# EAGLE schematic Baseboard (EAGLE 9.6.2)

## Sheet 1 of 15
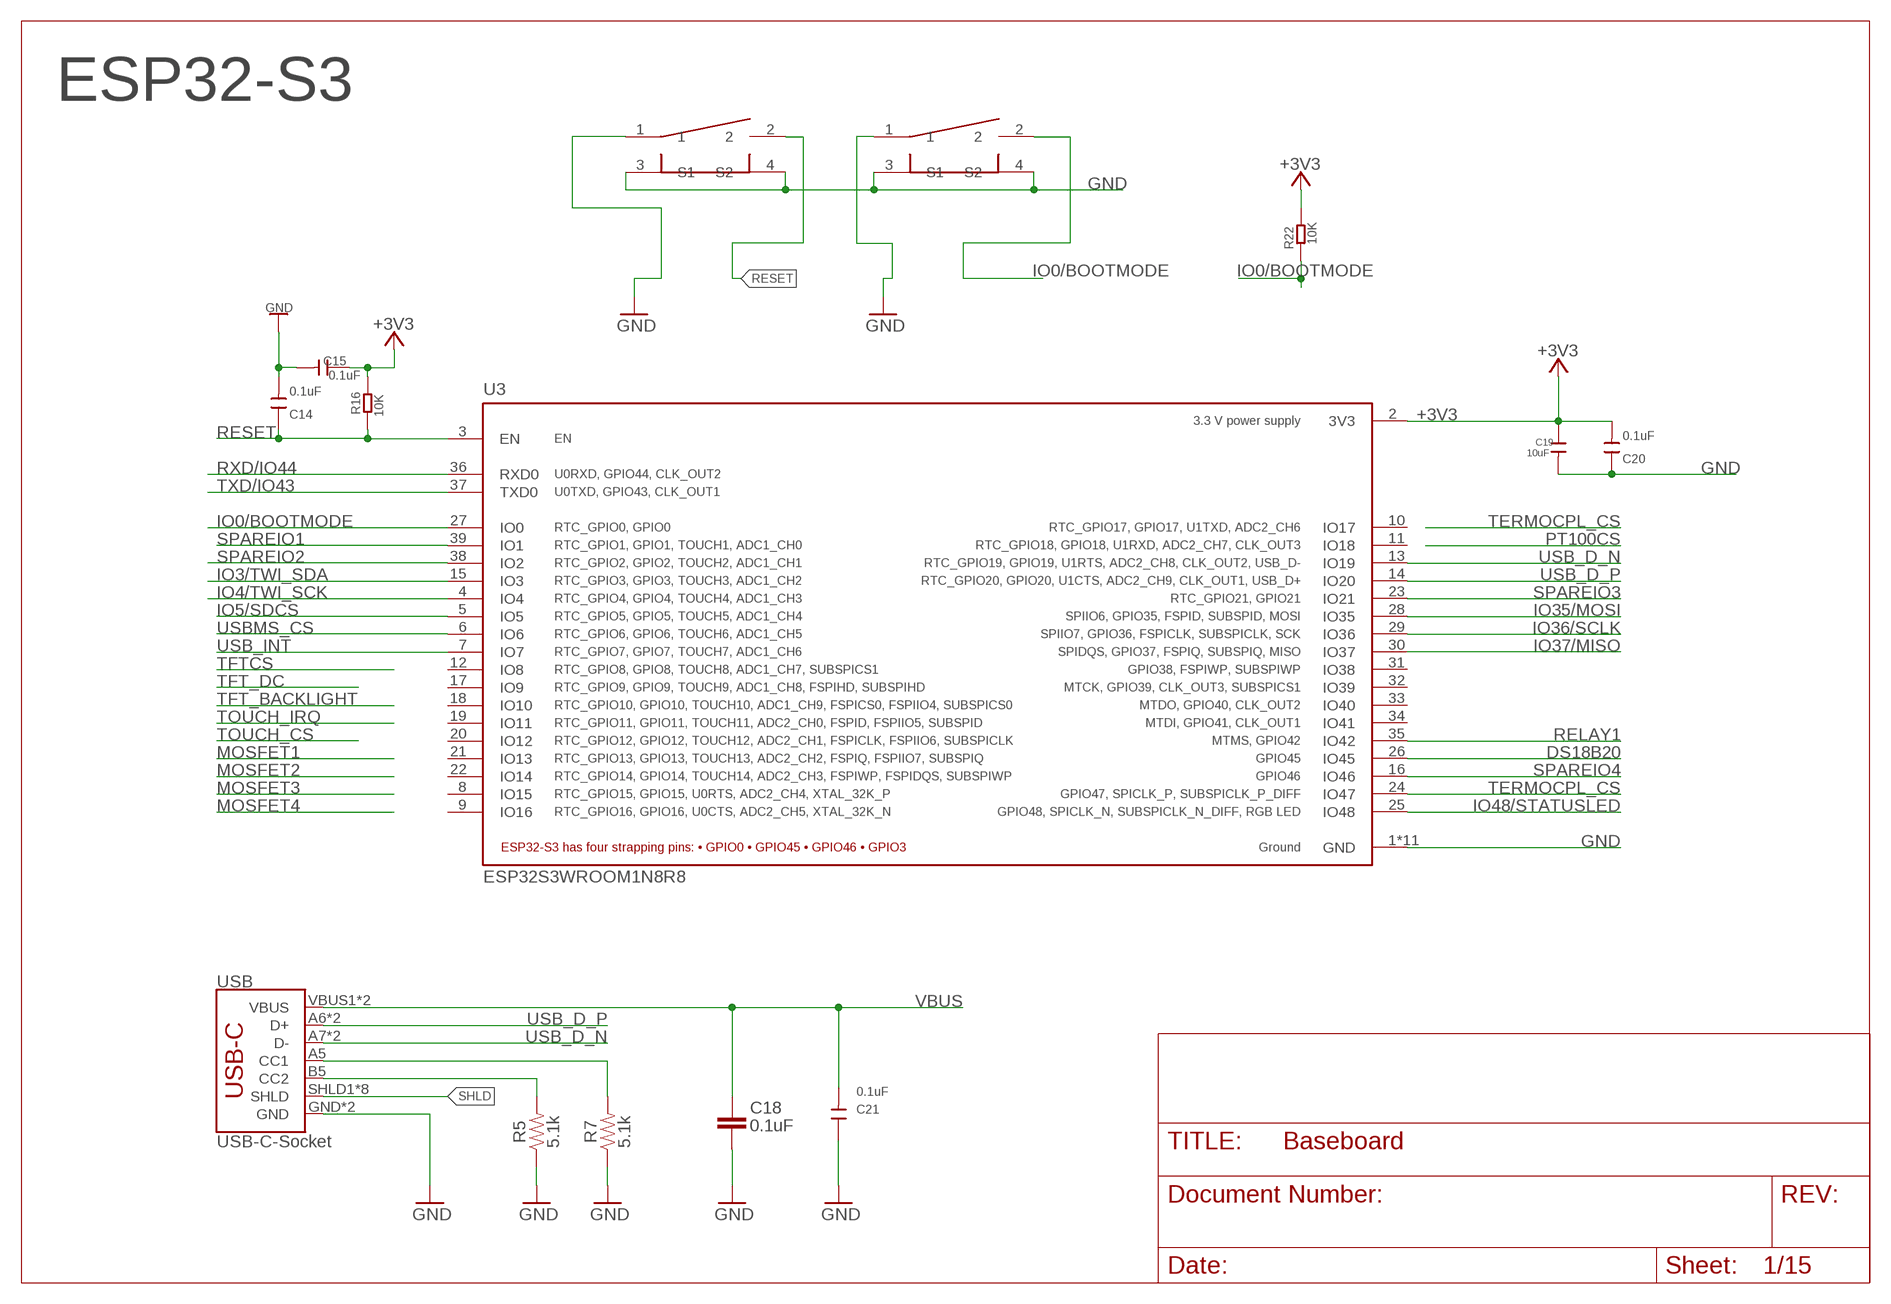
[diagram p0: schematic, sheet 1]

### Parts
C14  0.1uF  DISCRETE_C-0603  [DISCRETE_C0603]
C15  0.1uF  DISCRETE_C-0603  [DISCRETE_C0603]
C18  0.1uF  CAP0603-CAP  [0603-CAP]
C19  10uF  C-1206  [C1206]
C20  0.1uF  DISCRETE_C-0603  [DISCRETE_C0603]
C21  0.1uF  DISCRETE_C-0603  [DISCRETE_C0603]
MODE  RIGHTANGLETACTILE  [DP_DEVICES_SW_TACT_STANDARD_RIGHT_ANGLE]
R5  5.1k  5.1KOHM5.1KOHM-0603-1/10W-1%  [0603@1]
R7  5.1k  5.1KOHM5.1KOHM-0603-1/10W-1%  [0603@1]
R16  10K  R-0603  [R0603]
R22  10K  R-0603  [R0603]
RESET  RIGHTANGLETACTILE  [DP_DEVICES_SW_TACT_STANDARD_RIGHT_ANGLE]
U3  ESP32S3WROOM1N8R8  [XCVR_ESP32S3WROOM1N8R8]
USB  USB-C-Socket  USB_C16PIN  [USB-C-16P]

### Nets
+3V3: C15.1 C19.1 C20.2 R16.2 R22.2 U3.2(3V3) ; also sheet 2,6,7,8,9,10,11
CC1: R7.2 USB.A5(CC1)
CC2: R5.2 USB.B5(CC2)
DS18B20: U3.26(IO45) ; also sheet 12
GND: C14.2 C15.2 C18.2 C19.2 C20.1 C21.1 MODE.1 MODE.3(S1) MODE.4(S2) R5.1 R7.1 RESET.1 RESET.3(S1) RESET.4(S2) U3.1(GND) U3.40(GND) U3.41_1(GND) U3.41_2(GND) U3.41_3(GND) U3.41_4(GND) U3.41_5(GND) U3.41_6(GND) U3.41_7(GND) U3.41_8(GND) U3.41_9(GND) USB.GND USB.GND2(GND) ; also sheet 2,3,4,5,6,7,8,9,10,11,12,13,14,15
IO0/BOOTMODE: MODE.2 R22.1 U3.27(IO0)
IO3/TWI_SDA: U3.15(IO3) ; also sheet 3,4,5,10,11
IO4/TWI_SCK: U3.4(IO4) ; also sheet 3,4,5,10,11
IO5/SDCS: U3.5(IO5) ; also sheet 8
IO35/MOSI: U3.28(IO35) ; also sheet 3,7,8,9
IO36/SCLK: U3.29(IO36) ; also sheet 3,6,7,8,9
IO37/MISO: U3.30(IO37) ; also sheet 3,6,7,8,9
IO48/STATUSLED: U3.25(IO48) ; also sheet 3
RELAY1: U3.35(IO42) ; also sheet 12
RESET: C14.1 R16.1 RESET.2 U3.3(EN)
RXD/IO44: U3.36(RXD0) ; also sheet 3
SHLD: USB.SHLD1(SHLD) USB.SHLD2(SHLD) USB.SHLD3(SHLD) USB.SHLD4(SHLD) USB.SHLD5(SHLD) USB.SHLD6(SHLD) USB.SHLD7(SHLD) USB.SHLD8(SHLD)
SPAREIO1: U3.39(IO1) ; also sheet 3
SPAREIO2: U3.38(IO2) ; also sheet 3
SPAREIO3: U3.23(IO21) ; also sheet 3
SPAREIO4: U3.16(IO46) ; also sheet 3
TERMOCPL_CS: U3.24(IO47) ; also sheet 6
TXD/IO43: U3.37(TXD0) ; also sheet 3
USB_D_N: U3.13(IO19) USB.A7(D-) USB.B7(D-)
USB_D_P: U3.14(IO20) USB.A6(D+) USB.B6(D+)
USB_INT: U3.7(IO7) ; also sheet 9
USBMS_CS: U3.6(IO6) ; also sheet 9
VBUS: C18.1 C21.2 USB.VBUS1(VBUS) USB.VBUS2(VBUS) ; also sheet 2
Unconnected: U3.8(IO15) U3.9(IO16) U3.10(IO17) U3.11(IO18) U3.12(IO8) U3.17(IO9) U3.18(IO10) U3.19(IO11) U3.20(IO12) U3.21(IO13) U3.22(IO14) U3.31(IO38) U3.32(IO39) U3.33(IO40) U3.34(IO41)

### Notes on the sheet
- ESP32-S3

## Sheet 2 of 15
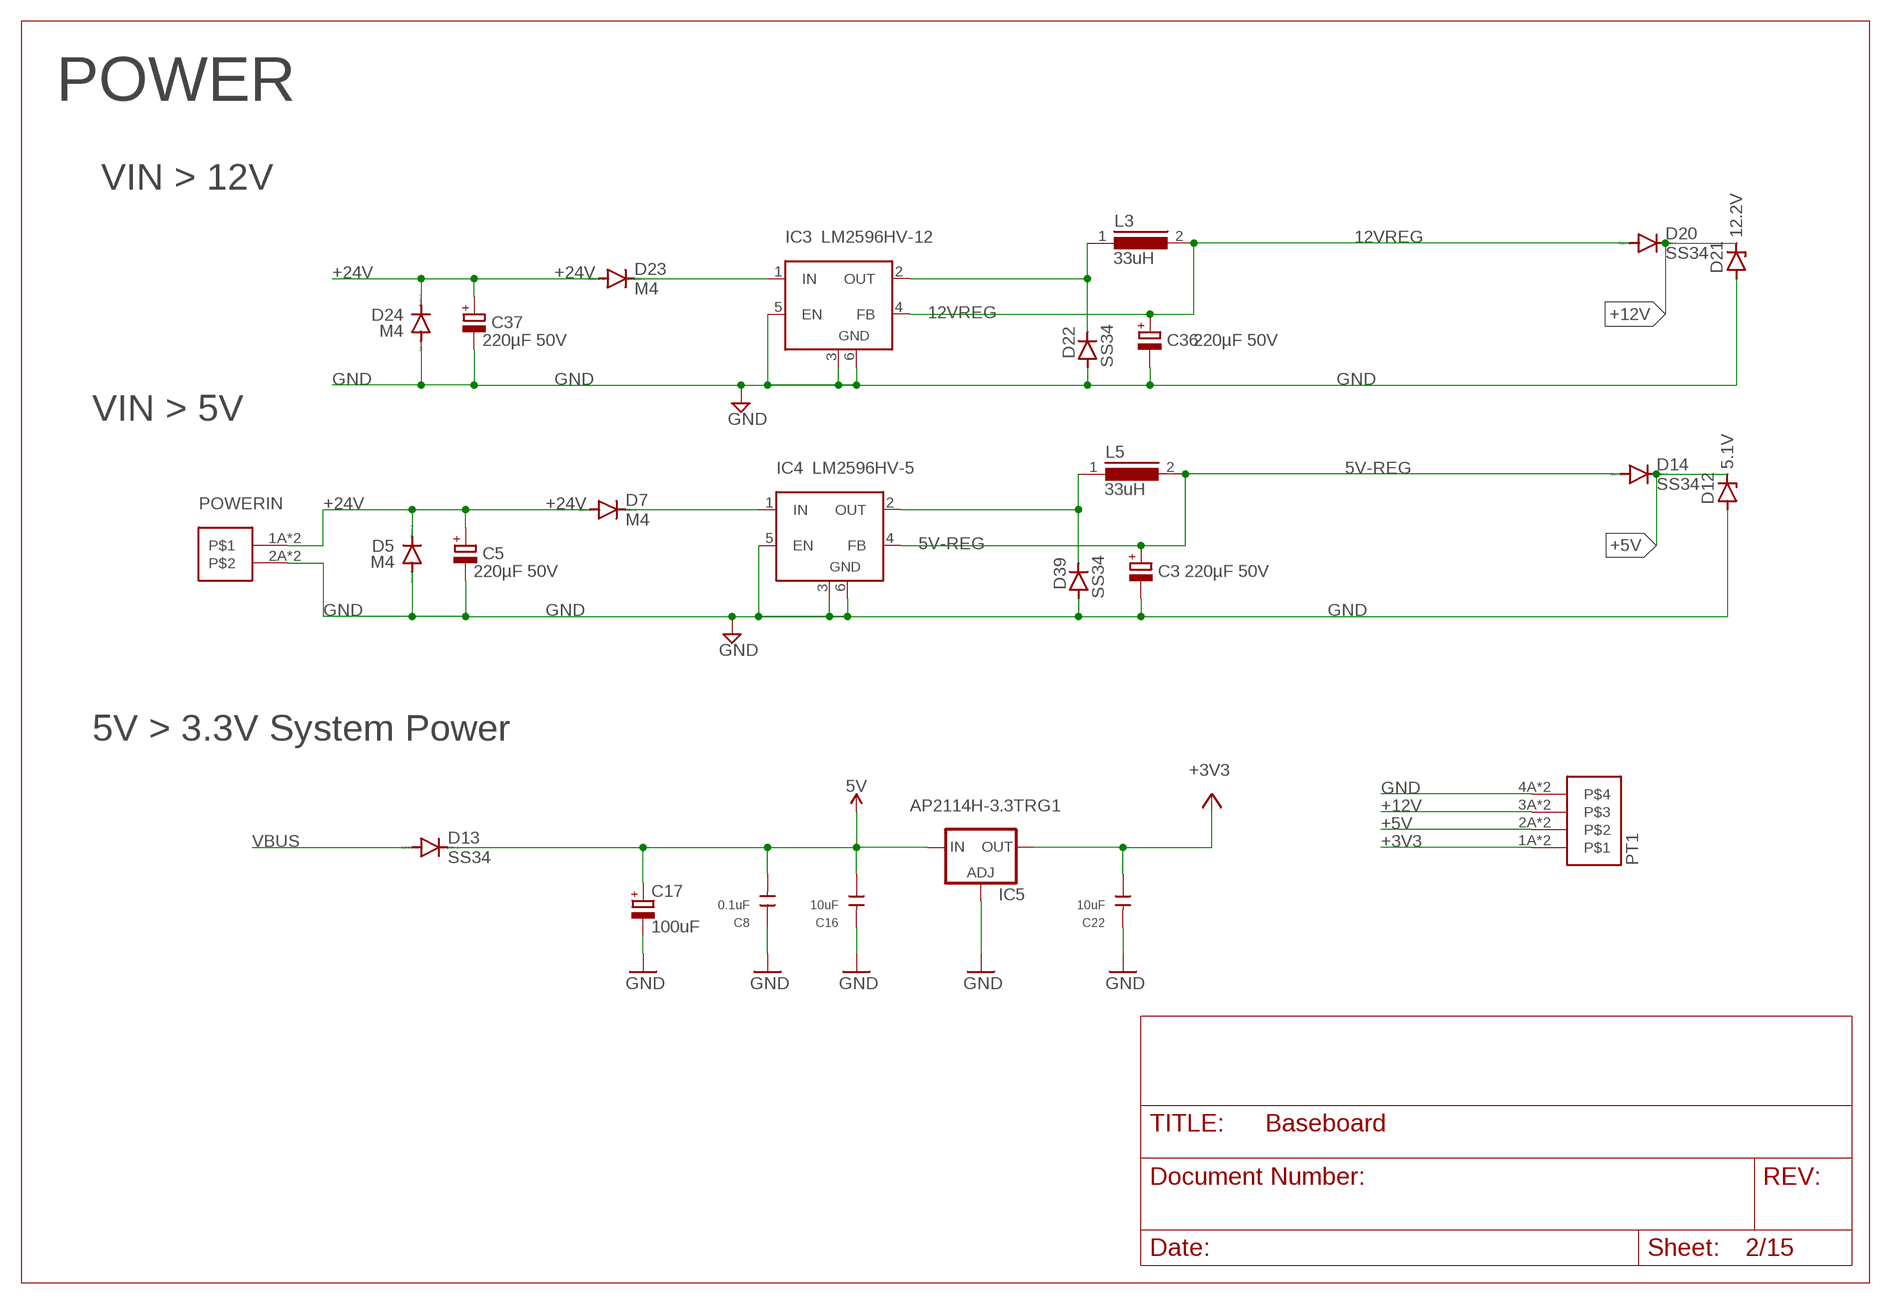
[diagram p1: schematic, sheet 2]

### Parts
C3  220µF 50V  CPOL-EUE  [PANASONIC_E]
C5  220µF 50V  CPOL-EUE  [PANASONIC_E]
C8  0.1uF  DISCRETE_C-0603  [DISCRETE_C0603]
C16  10uF  C-1206  [C1206]
C17  100uF  CPOL-EUD  [PANASONIC_D]
C22  10uF  C-1206  [C1206]
C36  220µF 50V  CPOL-EUE  [PANASONIC_E]
C37  220µF 50V  CPOL-EUE  [PANASONIC_E]
D5  M4  DIODE-DO-214AC  [DO-214AC]
D7  M4  DIODE-DO-214AC  [DO-214AC]
D12  5.1V  ZENER-DIODESMB  [SMB]
D13  SS34  DIODE-DO-214AC  [DO-214AC]
D14  SS34  DIODE-DO-214AC  [DO-214AC]
D20  SS34  DIODE-DO-214AC  [DO-214AC]
D21  12.2V  ZENER-DIODESMB  [SMB]
D22  SS34  D-SOD-87  [SOD87]
D23  M4  DIODE-DO-214AC  [DO-214AC]
D24  M4  DIODE-DO-214AC  [DO-214AC]
D39  SS34  D-SOD-87  [SOD87]
IC3  LM2596HV-12  LM2596S  [TO263-5]
IC4  LM2596HV-5  LM2596S  [TO263-5]
IC5  AP2114H-3.3TRG1  LD117AS33TR  [SOT223]
L3  33uH  DR127  [DR127]
L5  33uH  DR127  [DR127]
POWERIN  WJ212R-THR-3.5-2  [WJ212R-THR-3.5-2]
PT1  WJ212R-THR-3.5-4  [WJ212R-THR-3.5-4]

### Nets
5V-REG: C3.+ D14.A IC4.4(FB) L5.2
12VREG: C36.+ D20.A IC3.4(FB) L3.2
+3V3: C22.1 IC5.4(OUT) PT1.1A PT1.1B ; also sheet 1,6,7,8,9,10,11
+5V: C8.2 C16.1 C17.+ D12.C D13.C D14.C IC5.3(IN) PT1.2A PT1.2B ; supply symbol labelled 5V ; also sheet 3,4,5,9
+12V: D20.C D21.C PT1.3A PT1.3B
+24V: C5.+ C37.+ D5.C D7.A D23.A D24.C POWERIN.1A POWERIN.1B ; also sheet 5,10
+24V1: D7.C IC4.1(IN)
+24V2: D23.C IC3.1(IN)
GND: C3.- C5.- C8.1 C16.2 C17.- C22.2 C36.- C37.- D5.A D12.A D21.A D22.2(A) D24.A D39.2(A) IC3.3(GND) IC3.5(EN) IC3.6(GND) IC4.3(GND) IC4.5(EN) IC4.6(GND) IC5.1(ADJ) POWERIN.2A POWERIN.2B PT1.4A PT1.4B ; also sheet 1,3,4,5,6,7,8,9,10,11,12,13,14,15
N$37: D22.1(C) IC3.2(OUT) L3.1
N$164: D39.1(C) IC4.2(OUT) L5.1
VBUS: D13.A ; also sheet 1

### Notes on the sheet
- POWER
- VIN > 12V
- VIN > 5V
- 5V > 3.3V System Power

## Sheet 3 of 15
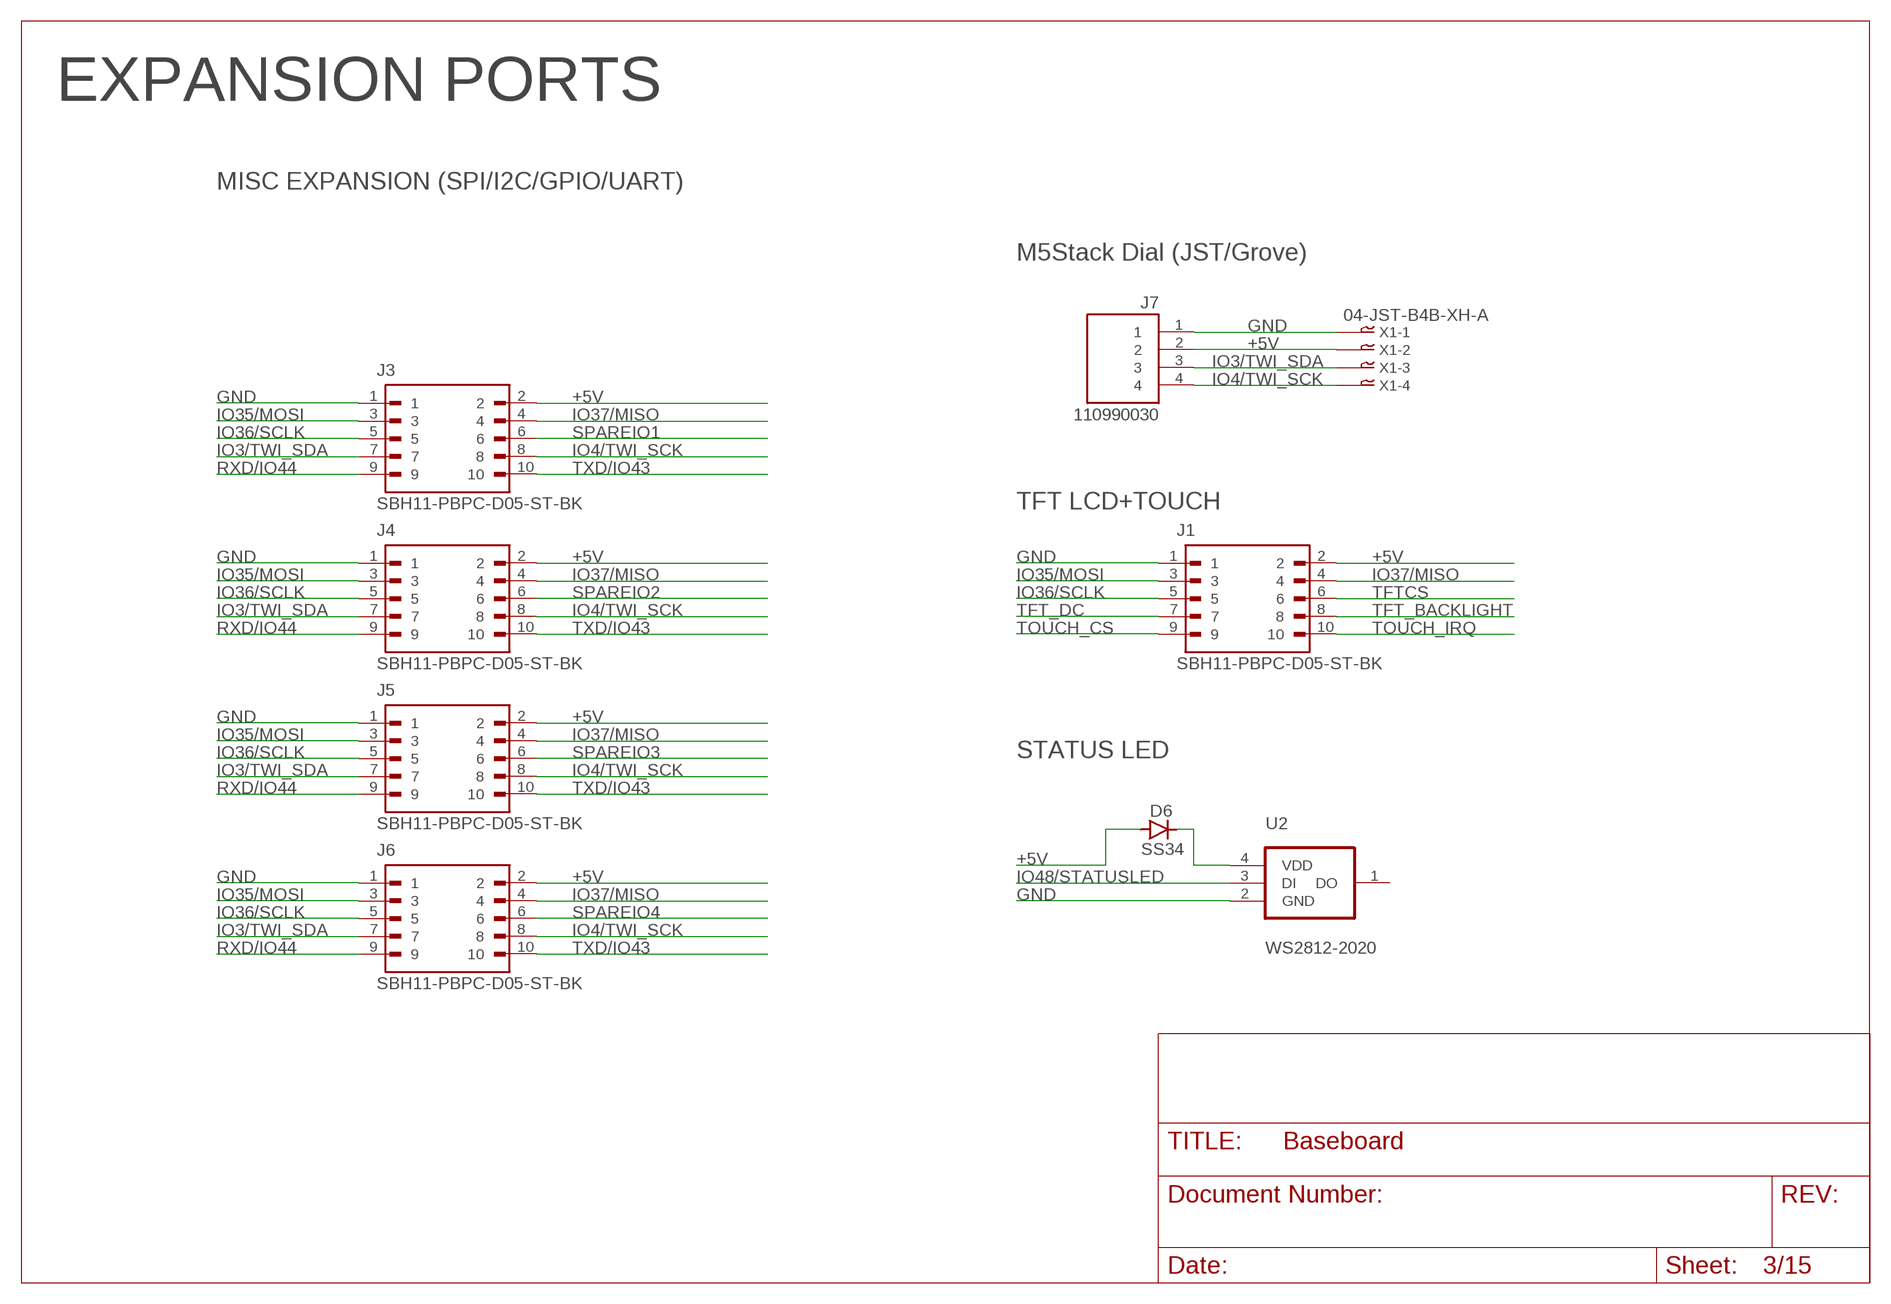
[diagram p2: schematic, sheet 3]

### Parts
D6  SS34  D-SOD-87  [SOD87]
J1  SBH11-PBPC-D05-ST-BK  [SULLINS_SBH11-PBPC-D05-ST-BK]
J3  SBH11-PBPC-D05-ST-BK  [SULLINS_SBH11-PBPC-D05-ST-BK]
J4  SBH11-PBPC-D05-ST-BK  [SULLINS_SBH11-PBPC-D05-ST-BK]
J5  SBH11-PBPC-D05-ST-BK  [SULLINS_SBH11-PBPC-D05-ST-BK]
J6  SBH11-PBPC-D05-ST-BK  [SULLINS_SBH11-PBPC-D05-ST-BK]
J7  110990030  [SEEED_110990030]
U2  WS2812-2020  [LED_WS2812-2020]
X1  04-JST-B4B-XH-A  [B4B-XH]

### Nets
+5V: D6.2(A) J1.2 J3.2 J4.2 J5.2 J6.2 J7.2 X1.P$2 ; also sheet 2,4,5,9
GND: J1.1 J3.1 J4.1 J5.1 J6.1 J7.1 U2.2(GND) X1.P$1 ; also sheet 1,2,4,5,6,7,8,9,10,11,12,13,14,15
IO3/TWI_SDA: J3.7 J4.7 J5.7 J6.7 J7.3 X1.P$3 ; also sheet 1,4,5,10,11
IO4/TWI_SCK: J3.8 J4.8 J5.8 J6.8 J7.4 X1.P$4 ; also sheet 1,4,5,10,11
IO35/MOSI: J1.3 J3.3 J4.3 J5.3 J6.3 ; also sheet 1,7,8,9
IO36/SCLK: J1.5 J3.5 J4.5 J5.5 J6.5 ; also sheet 1,6,7,8,9
IO37/MISO: J1.4 J3.4 J4.4 J5.4 J6.4 ; also sheet 1,6,7,8,9
IO48/STATUSLED: U2.3(DI) ; also sheet 1
N$11: D6.1(C) U2.4(VDD)
RXD/IO44: J3.9 J4.9 J5.9 J6.9 ; also sheet 1
SPAREIO1: J3.6 ; also sheet 1
SPAREIO2: J4.6 ; also sheet 1
SPAREIO3: J5.6 ; also sheet 1
SPAREIO4: J6.6 ; also sheet 1
TFT_BACKLIGHT: J1.8 ; also sheet 1
TFT_DC: J1.7 ; also sheet 1
TFTCS: J1.6 ; also sheet 1
TOUCH_CS: J1.9 ; also sheet 1
TOUCH_IRQ: J1.10 ; also sheet 1
TXD/IO43: J3.10 J4.10 J5.10 J6.10 ; also sheet 1
Unconnected: U2.1(DO)

### Notes on the sheet
- EXPANSION PORTS
- MISC EXPANSION (SPI/I2C/GPIO/UART)
- M5Stack Dial (JST/Grove)
- TFT LCD+TOUCH
- STATUS LED

## Sheet 4 of 15
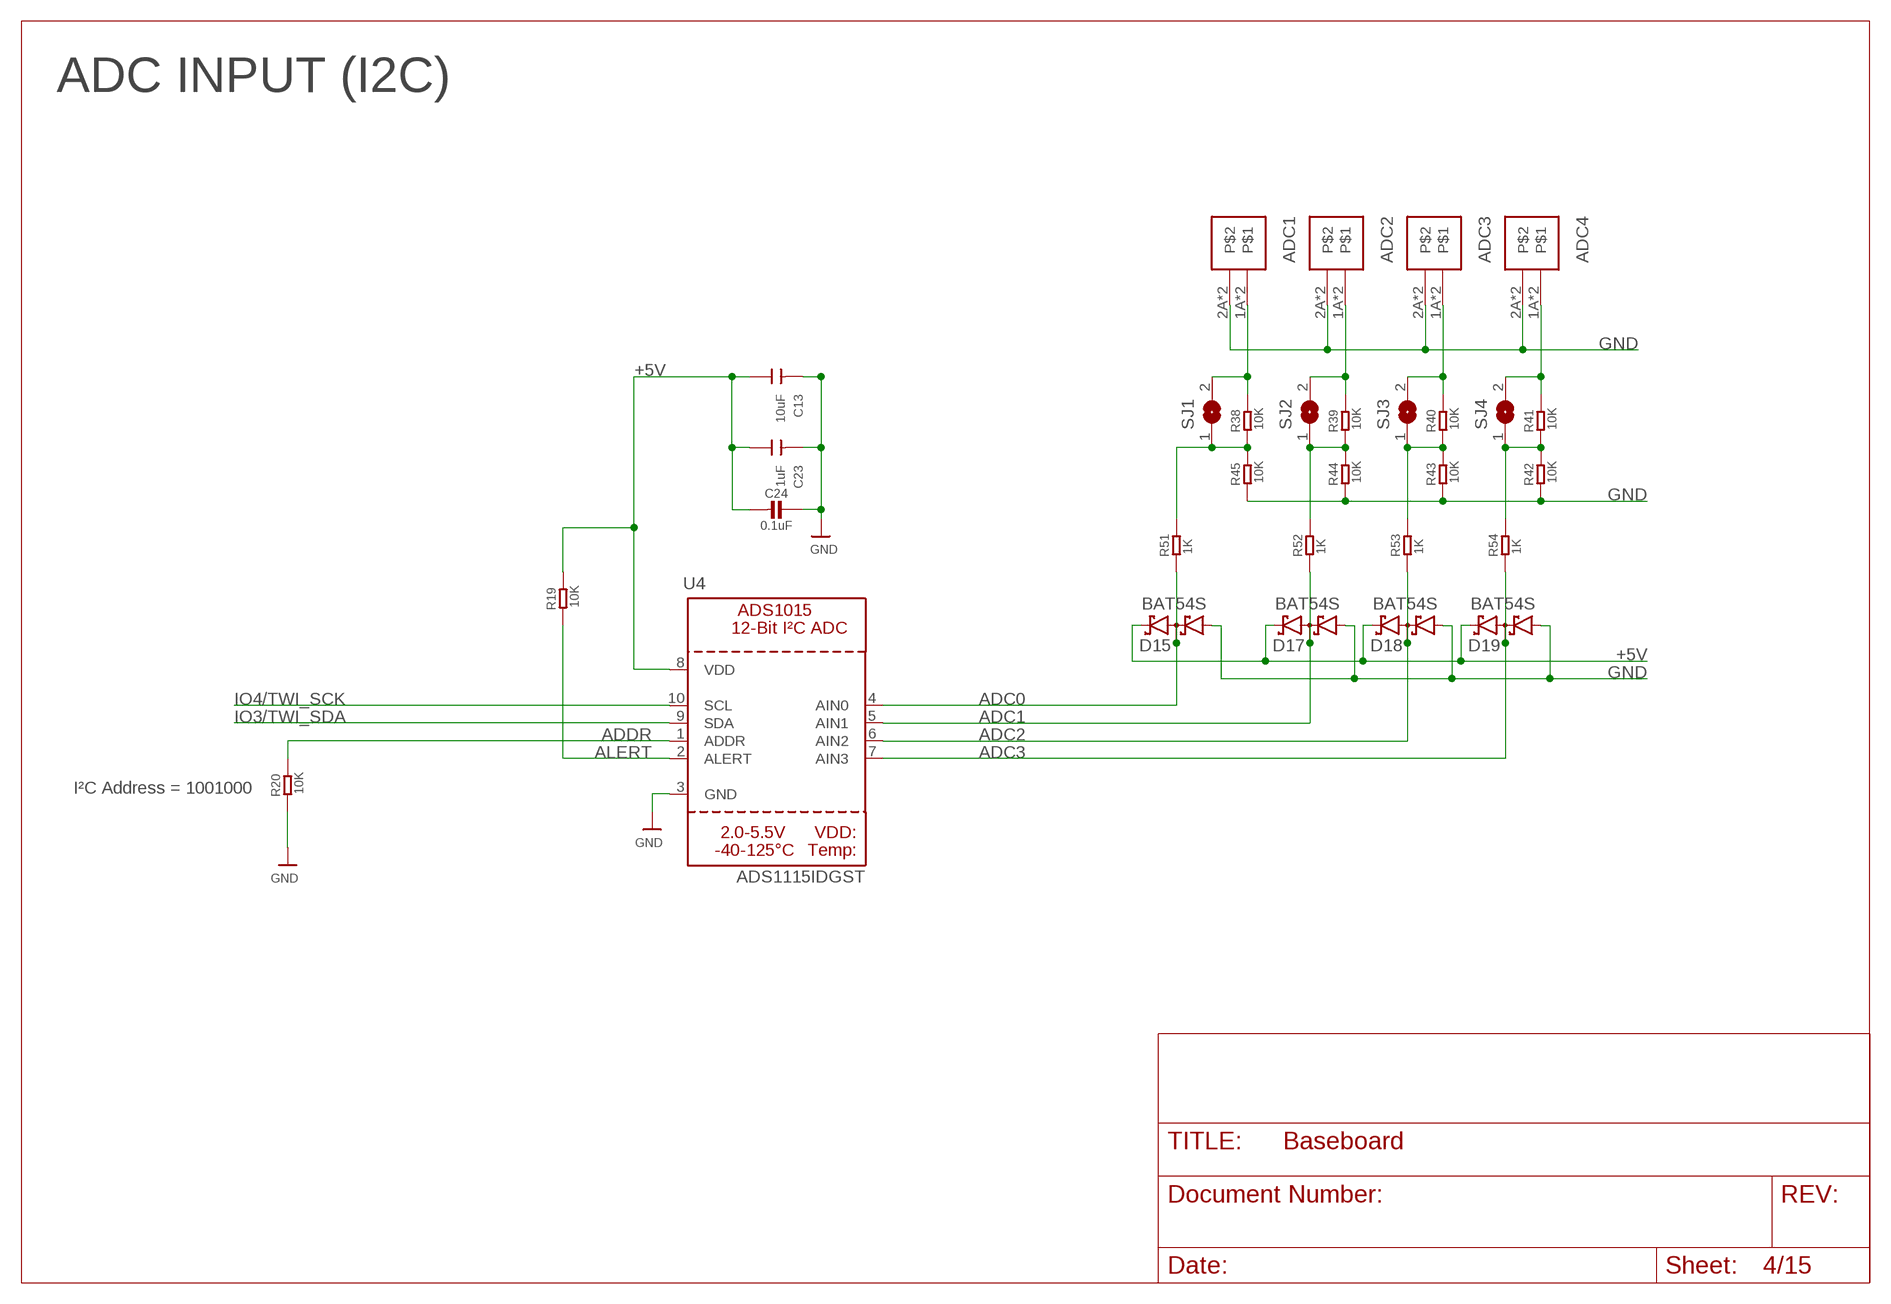
[diagram p3: schematic, sheet 4]

### Parts
ADC1  WJ212R-THR-3.5-2  [WJ212R-THR-3.5-2]
ADC2  WJ212R-THR-3.5-2  [WJ212R-THR-3.5-2]
ADC3  WJ212R-THR-3.5-2  [WJ212R-THR-3.5-2]
ADC4  WJ212R-THR-3.5-2  [WJ212R-THR-3.5-2]
C13  10uF  C-1206  [C1206]
C23  1uF  C-1206  [C1206]
C24  0.1uF  CAP_CERAMIC0805-NOOUTLINE  [0805-NO]
D15  BAT54S  [SOT23]
D17  BAT54S  [SOT23]
D18  BAT54S  [SOT23]
D19  BAT54S  [SOT23]
R19  10K  R-0603  [R0603]
R20  10K  R-0603  [R0603]
R38  10K  R-0204/5  [R0204/5]
R39  10K  R-0204/5  [R0204/5]
R40  10K  R-0204/5  [R0204/5]
R41  10K  R-0204/5  [R0204/5]
R42  10K  R-0204/5  [R0204/5]
R43  10K  R-0204/5  [R0204/5]
R44  10K  R-0204/5  [R0204/5]
R45  10K  R-0204/5  [R0204/5]
R51  1K  R-0204/5  [R0204/5]
R52  1K  R-0204/5  [R0204/5]
R53  1K  R-0204/5  [R0204/5]
R54  1K  R-0204/5  [R0204/5]
SJ1  SJ  [SJ]
SJ2  SJ  [SJ]
SJ3  SJ  [SJ]
SJ4  SJ  [SJ]
U4  ADS1115IDGST  ADC_ADS1015  [MSOP10]

### Nets
+5V: C13.1 C23.1 C24.2 D15.2(C2) D17.2(C2) D18.2(C2) D19.2(C2) R19.1 U4.8(VDD) ; also sheet 2,3,5,9
ADC0: D15.3(C1A2) R51.2 U4.4(AIN0)
ADC1: D17.3(C1A2) R52.2 U4.5(AIN1)
ADC2: D18.3(C1A2) R53.2 U4.6(AIN2)
ADC3: D19.3(C1A2) R54.2 U4.7(AIN3)
ADDR: R20.1 U4.1(ADDR) ; also sheet 5
ALERT: R19.2 U4.2(ALERT) ; also sheet 5
GND: ADC1.2A ADC1.2B ADC2.2A ADC2.2B ADC3.2A ADC3.2B ADC4.2A ADC4.2B C13.2 C23.2 C24.1 D15.1(A1) D17.1(A1) D18.1(A1) D19.1(A1) R20.2 R42.2 R43.2 R44.2 R45.2 U4.3(GND) ; also sheet 1,2,3,5,6,7,8,9,10,11,12,13,14,15
IO3/TWI_SDA: U4.9(SDA) ; also sheet 1,3,5,10,11
IO4/TWI_SCK: U4.10(SCL) ; also sheet 1,3,5,10,11
N$17: ADC1.1A ADC1.1B R38.1 SJ1.2
N$18: ADC2.1A ADC2.1B R39.1 SJ2.2
N$19: ADC3.1A ADC3.1B R40.1 SJ3.2
N$20: ADC4.1A ADC4.1B R41.1 SJ4.2
N$33: R38.2 R45.1 R51.1 SJ1.1
N$34: R39.2 R44.1 R52.1 SJ2.1
N$35: R40.2 R43.1 R53.1 SJ3.1
N$36: R41.2 R42.1 R54.1 SJ4.1

### Notes on the sheet
- ADC INPUT (I2C)
- I²C Address = 1001000

## Sheet 5 of 15
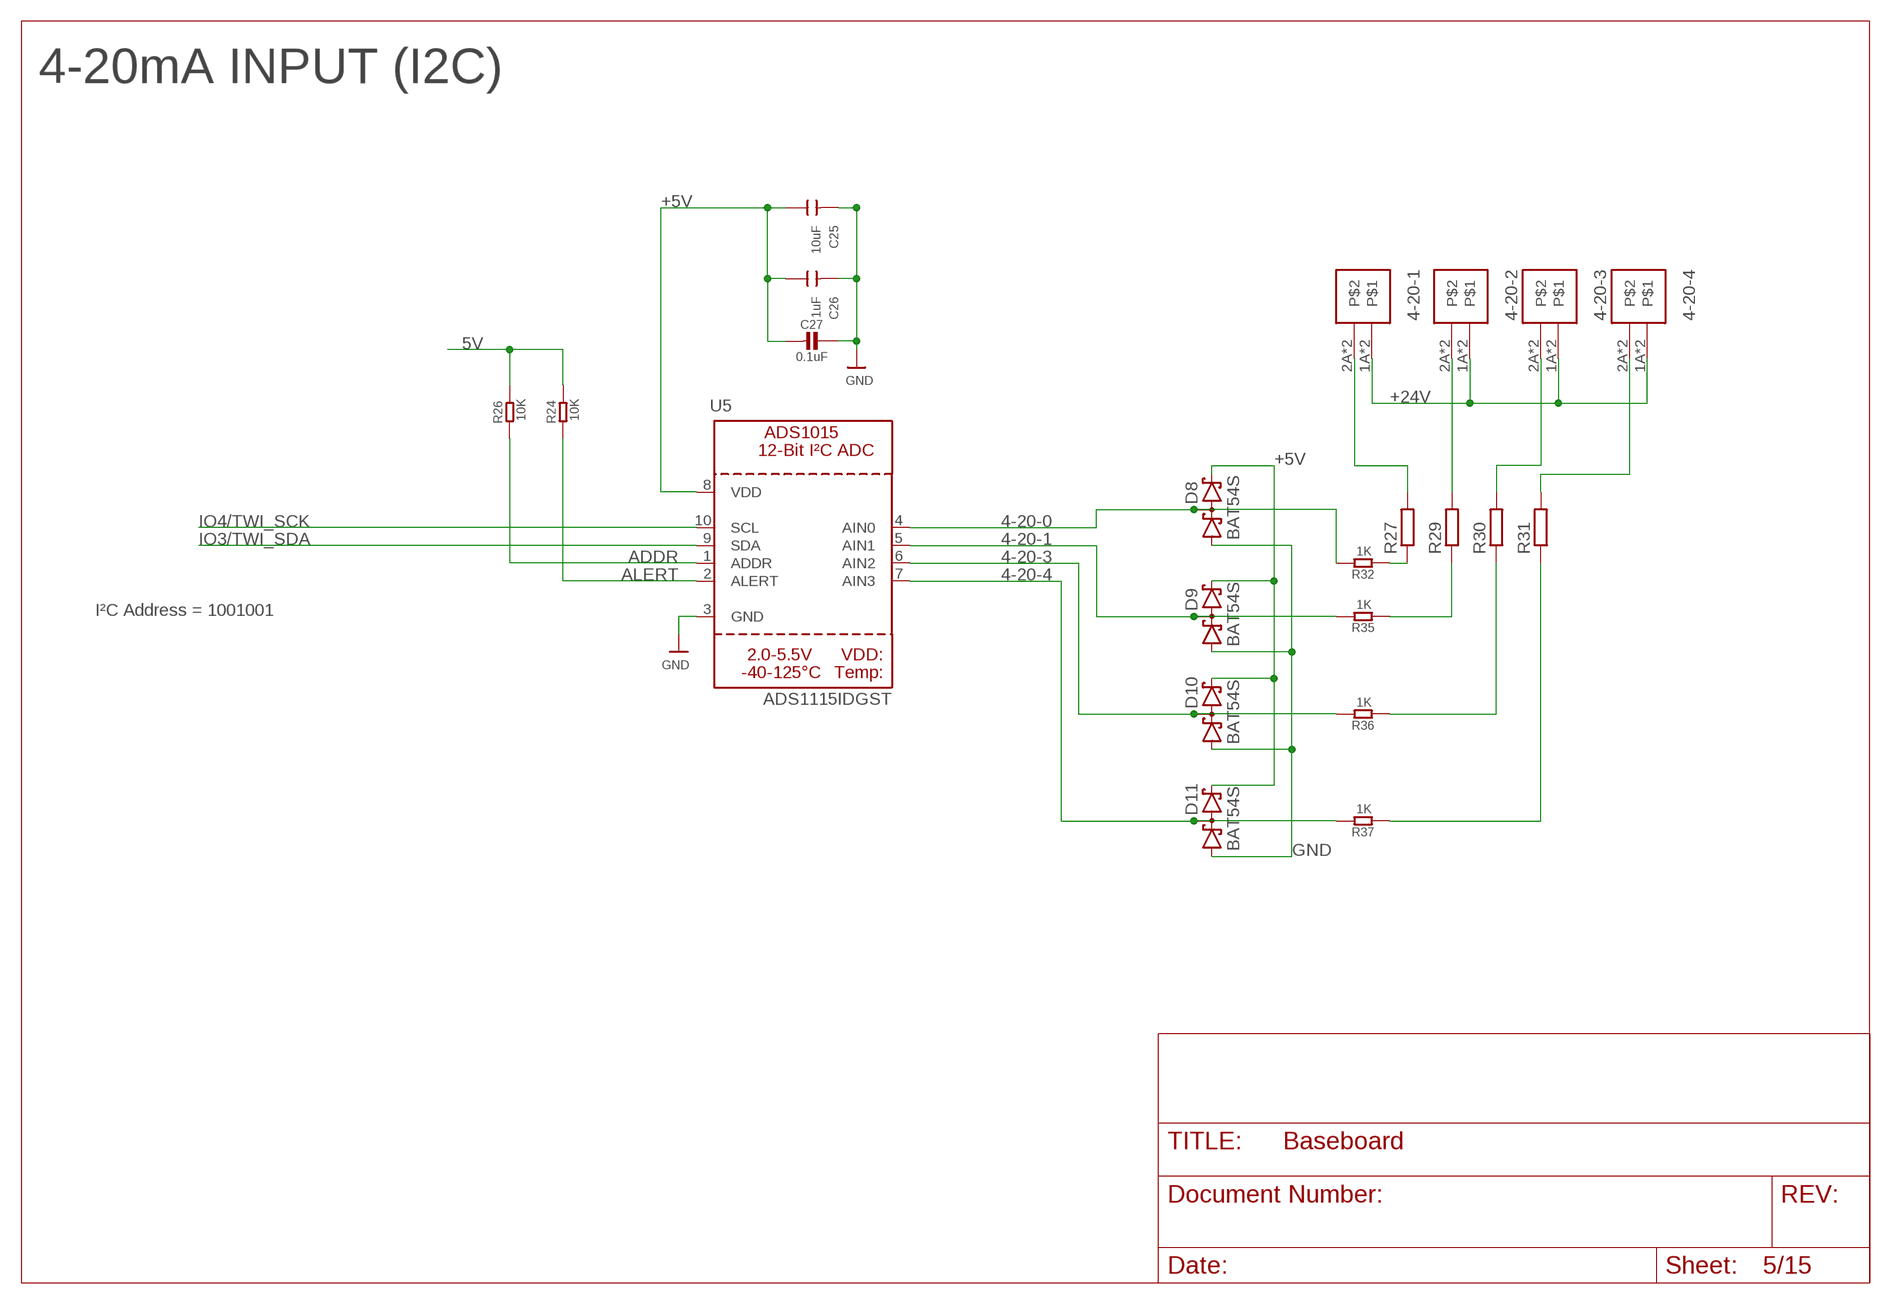
[diagram p4: schematic, sheet 5]

### Parts
4-20-1  WJ212R-THR-3.5-2  [WJ212R-THR-3.5-2]
4-20-2  WJ212R-THR-3.5-2  [WJ212R-THR-3.5-2]
4-20-3  WJ212R-THR-3.5-2  [WJ212R-THR-3.5-2]
4-20-4  WJ212R-THR-3.5-2  [WJ212R-THR-3.5-2]
C25  10uF  C-1206  [C1206]
C26  1uF  C-1206  [C1206]
C27  0.1uF  CAP_CERAMIC0805-NOOUTLINE  [0805-NO]
D8  BAT54S  [SOT23]
D9  BAT54S  [SOT23]
D10  BAT54S  [SOT23]
D11  BAT54S  [SOT23]
R24  10K  R-0603  [R0603]
R26  10K  R-0603  [R0603]
R27  R-EU_R2512  [R2512]
R29  R-EU_R2512  [R2512]
R30  R-EU_R2512  [R2512]
R31  R-EU_R2512  [R2512]
R32  1K  R-0603  [R0603]
R35  1K  R-0603  [R0603]
R36  1K  R-0603  [R0603]
R37  1K  R-0603  [R0603]
U5  ADS1115IDGST  ADC_ADS1015  [MSOP10]

### Nets
4-20-0: D8.3(C1A2) R32.1 U5.4(AIN0)
4-20-1: D9.3(C1A2) R35.1 U5.5(AIN1)
4-20-3: D10.3(C1A2) R36.1 U5.6(AIN2)
4-20-4: D11.3(C1A2) R37.1 U5.7(AIN3)
5V: R24.1 R26.1 ; also sheet 12
+5V: C25.1 C26.1 C27.2 D8.2(C2) D9.2(C2) D10.2(C2) D11.2(C2) U5.8(VDD) ; also sheet 2,3,4,9
+24V: 4-20-1.1A 4-20-1.1B 4-20-2.1A 4-20-2.1B 4-20-3.1A 4-20-3.1B 4-20-4.1A 4-20-4.1B ; also sheet 2,10
ADDR: R26.2 U5.1(ADDR) ; also sheet 4
ALERT: R24.2 U5.2(ALERT) ; also sheet 4
GND: C25.2 C26.2 C27.1 D8.1(A1) D9.1(A1) D10.1(A1) D11.1(A1) U5.3(GND) ; also sheet 1,2,3,4,6,7,8,9,10,11,12,13,14,15
IO3/TWI_SDA: U5.9(SDA) ; also sheet 1,3,4,10,11
IO4/TWI_SCK: U5.10(SCL) ; also sheet 1,3,4,10,11
N$21: R31.1 R37.2
N$22: R30.1 R36.2
N$23: R29.1 R35.2
N$24: R27.1 R32.2
N$25: 4-20-1.2A 4-20-1.2B R27.2
N$26: 4-20-2.2A 4-20-2.2B R29.2
N$27: 4-20-3.2A 4-20-3.2B R30.2
N$28: 4-20-4.2A 4-20-4.2B R31.2

### Notes on the sheet
- 4-20mA INPUT (I2C)
- I²C Address = 1001001

## Sheet 6 of 15
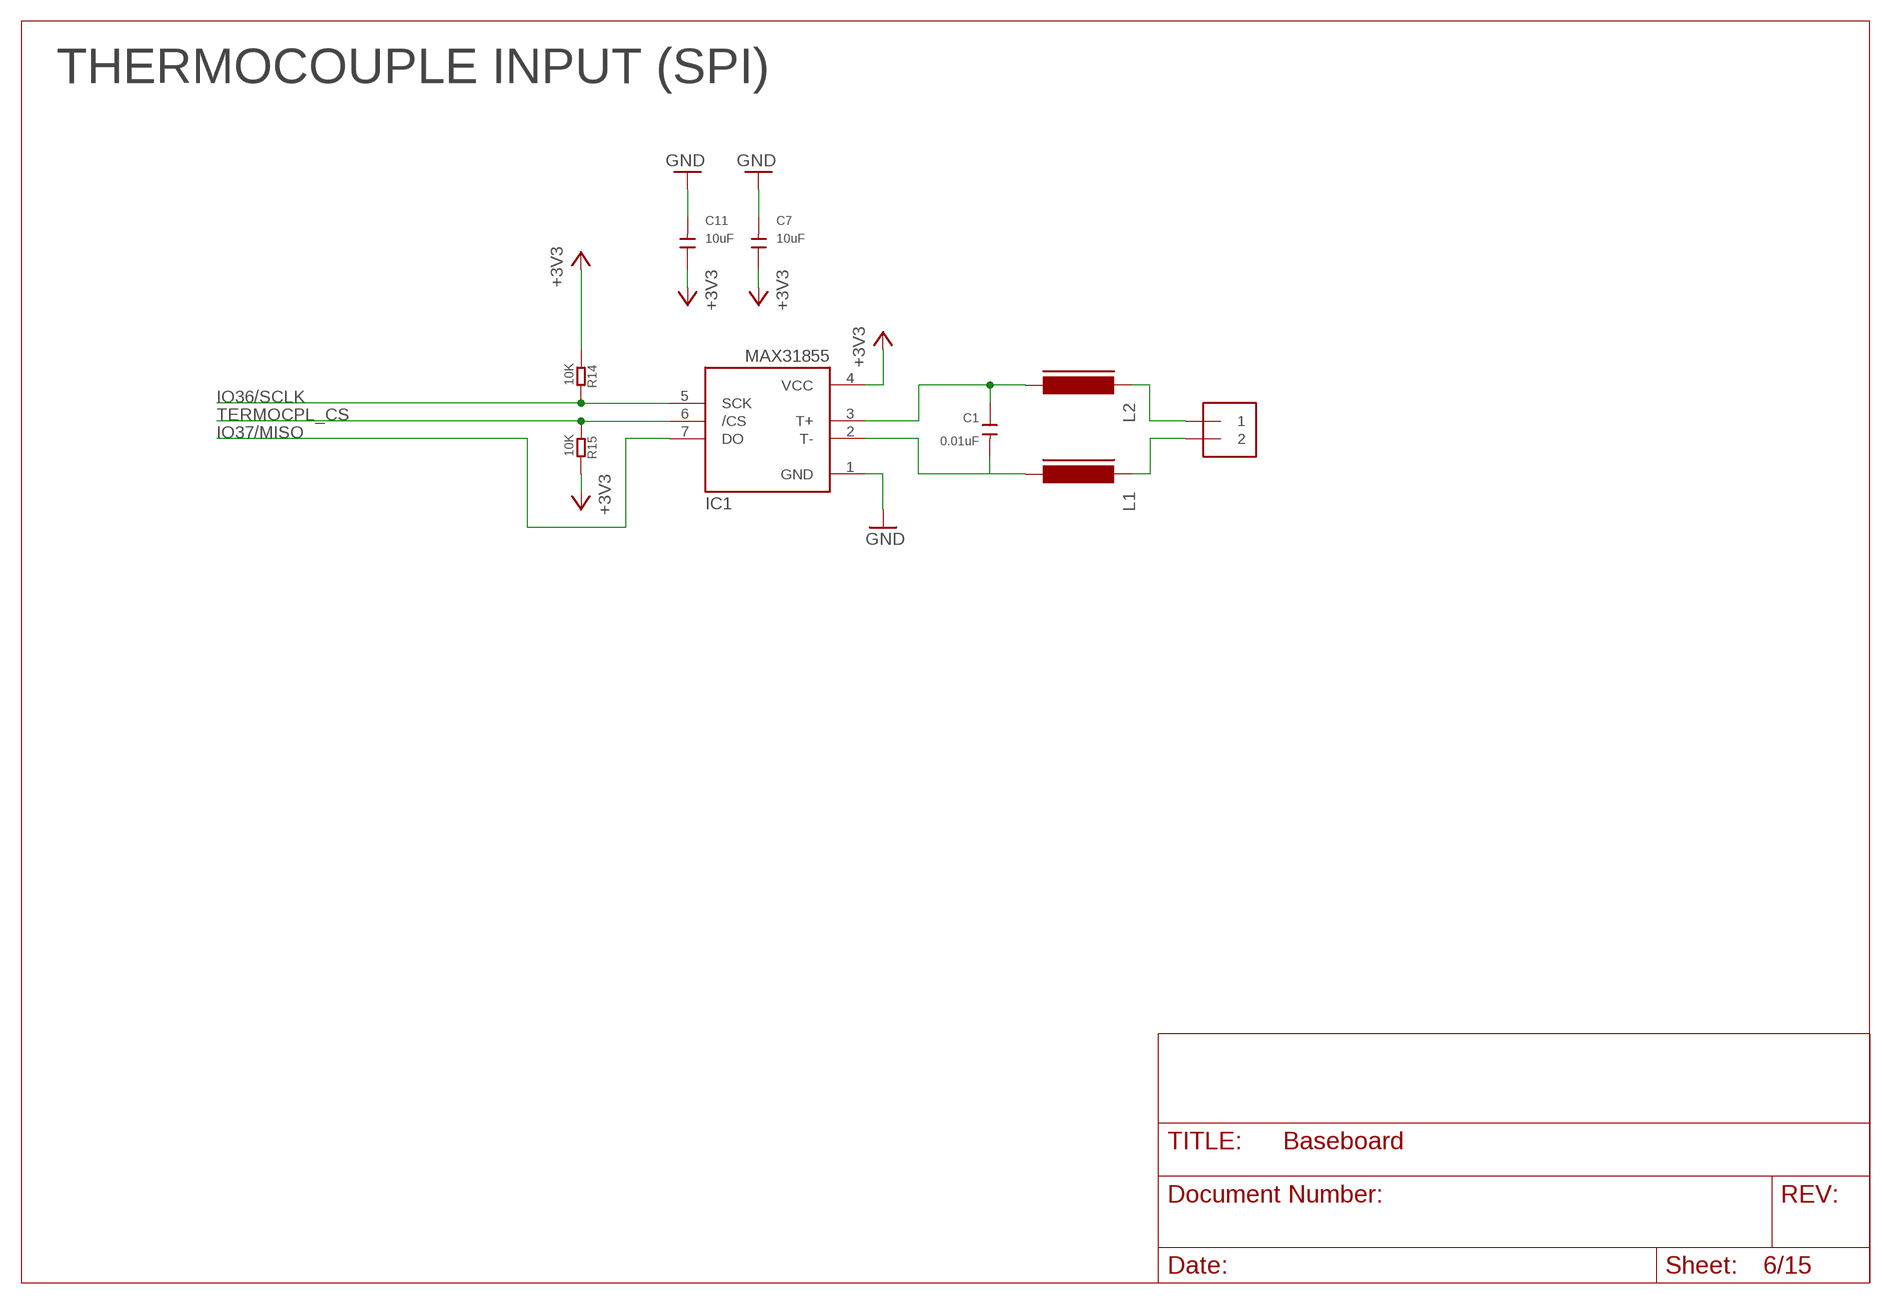
[diagram p5: schematic, sheet 6]

### Parts
C1  0.01uF  DISCRETE_C-0603  [DISCRETE_C0603]
C7  10uF  C-1206  [C1206]
C11  10uF  C-1206  [C1206]
IC1  MAX31855  MAX6675  [SO08]
J9  1X2-3.5MM  [1X2-3.5MM]
L1  FERRITE-0805  [FB805]
L2  FERRITE-0805  [FB805]
R14  10K  R-0603  [R0603]
R15  10K  R-0603  [R0603]

### Nets
+3V3: C7.1 C11.1 IC1.4(VCC) R14.1 R15.2 ; also sheet 1,2,7,8,9,10,11
GND: C7.2 C11.2 IC1.1(GND) ; also sheet 1,2,3,4,5,7,8,9,10,11,12,13,14,15
IO36/SCLK: IC1.5(SCK) R14.2 ; also sheet 1,3,7,8,9
IO37/MISO: IC1.7(DO) ; also sheet 1,3,7,8,9
N$7: J9.2 L1.1
N$14: C1.2 IC1.2(T-) L1.2
N$15: J9.1 L2.1
N$16: C1.1 IC1.3(T+) L2.2
TERMOCPL_CS: IC1.6(/CS) R15.1 ; also sheet 1

### Notes on the sheet
- THERMOCOUPLE INPUT (SPI)

## Sheet 7 of 15
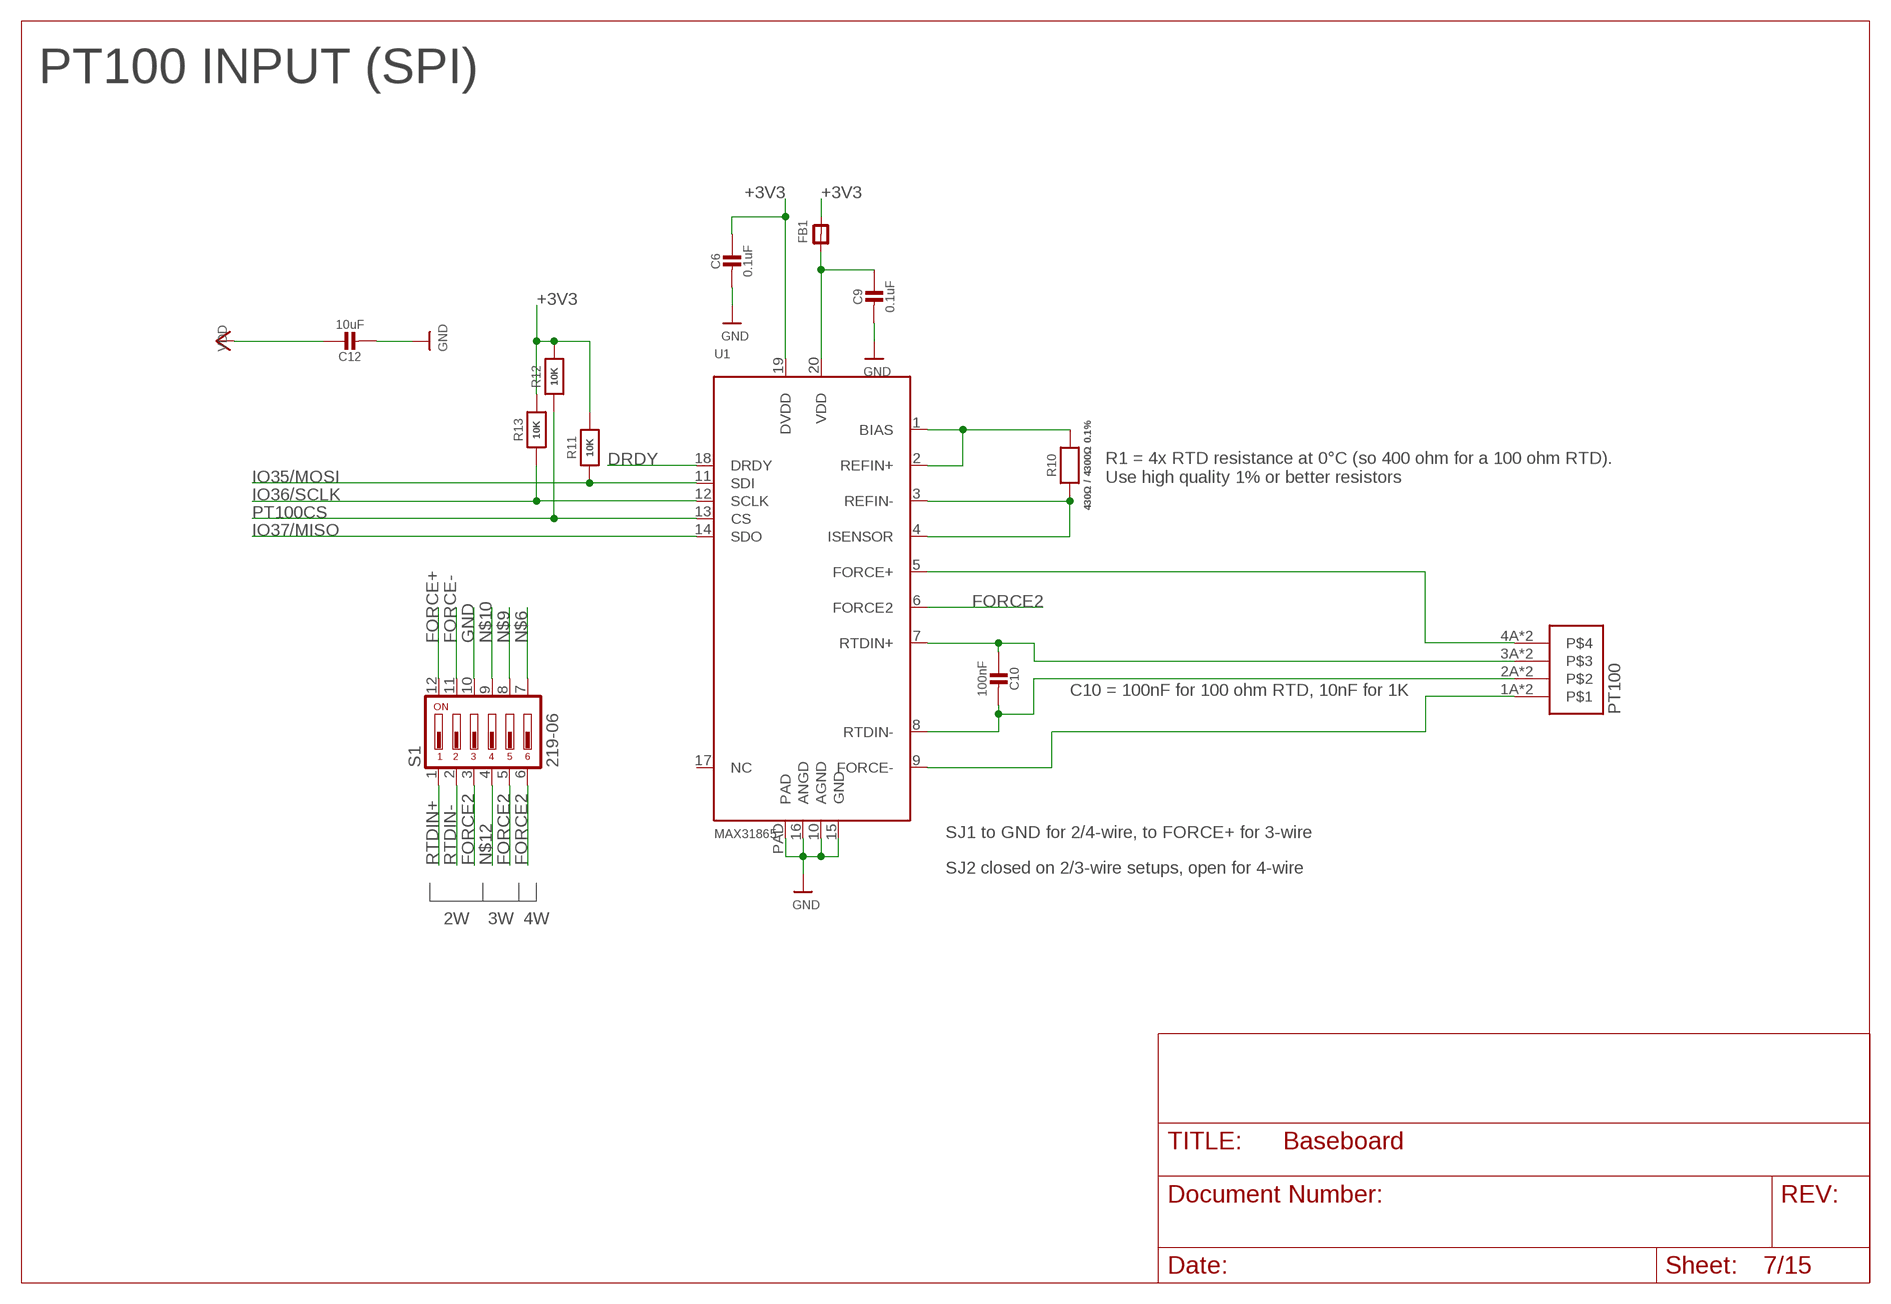
[diagram p6: schematic, sheet 7]

### Parts
C6  0.1uF  CAP_CERAMIC0805-NOOUTLINE  [0805-NO]
C9  0.1uF  CAP_CERAMIC0805-NOOUTLINE  [0805-NO]
C10  100nF  CAP_CERAMIC0805-NOOUTLINE  [0805-NO]
C12  10uF  CAP_CERAMIC0805-NOOUTLINE  [0805-NO]
FB1  FERRITE-0805NO  [0805-NO]
PT100  WJ212R-THR-3.5-4  [WJ212R-THR-3.5-4]
R10  430Ω / 4300Ω 0.1%  RESISTOR0805_NOOUTLINE  [0805-NO]
R11  10K  RESISTOR0805_NOOUTLINE  [0805-NO]
R12  10K  RESISTOR0805_NOOUTLINE  [0805-NO]
R13  10K  RESISTOR0805_NOOUTLINE  [0805-NO]
S1  219-06  [CTS-219-06]
U1  MAX31865  TEMP_MAX31865  [QFN20_4MM_0.65MM]

### Nets
+3V3: C6.1 C12.1 FB1.2 R11.2 R12.2 R13.2 U1.19(DVDD) ; supply symbol labelled VDD ; also sheet 1,2,6,8,9,10,11
DRDY: U1.18(DRDY)
FORCE2: S1.3 S1.5 S1.6 U1.6(FORCE2)
FORCE+: PT100.4A PT100.4B S1.12 U1.5(FORCE+)
FORCE-: PT100.1A PT100.1B S1.11 U1.9(FORCE-)
GND: C6.2 C9.2 C12.2 S1.10 U1.10(AGND) U1.15(GND) U1.16(ANGD) U1.PAD ; also sheet 1,2,3,4,5,6,8,9,10,11,12,13,14,15
IO35/MOSI: R11.1 U1.11(SDI) ; also sheet 1,3,8,9
IO36/SCLK: R13.1 U1.12(SCLK) ; also sheet 1,3,6,8,9
IO37/MISO: U1.14(SDO) ; also sheet 1,3,6,8,9
N$4: R10.2 U1.1(BIAS) U1.2(REFIN+)
N$5: R10.1 U1.3(REFIN-) U1.4(ISENSOR)
N$6: S1.7
N$8: C9.1 FB1.1 U1.20(VDD)
N$9: S1.8
N$10: S1.9
N$12: S1.4
PT100CS: R12.1 U1.13(CS) ; also sheet 1
RTDIN+: C10.1 PT100.3A PT100.3B S1.1 U1.7(RTDIN+)
RTDIN-: C10.2 PT100.2A PT100.2B S1.2 U1.8(RTDIN-)
Unconnected: U1.17(NC)

### Notes on the sheet
- PT100 INPUT (SPI)
- R1 = 4x RTD resistance at 0°C (so 400 ohm for a 100 ohm RTD).
  Use high quality 1% or better resistors
- C10 = 100nF for 100 ohm RTD, 10nF for 1K
- SJ1 to GND for 2/4-wire, to FORCE+ for 3-wire
- SJ2 closed on 2/3-wire setups, open for 4-wire
- 2W | 3W | 4W

## Sheet 8 of 15
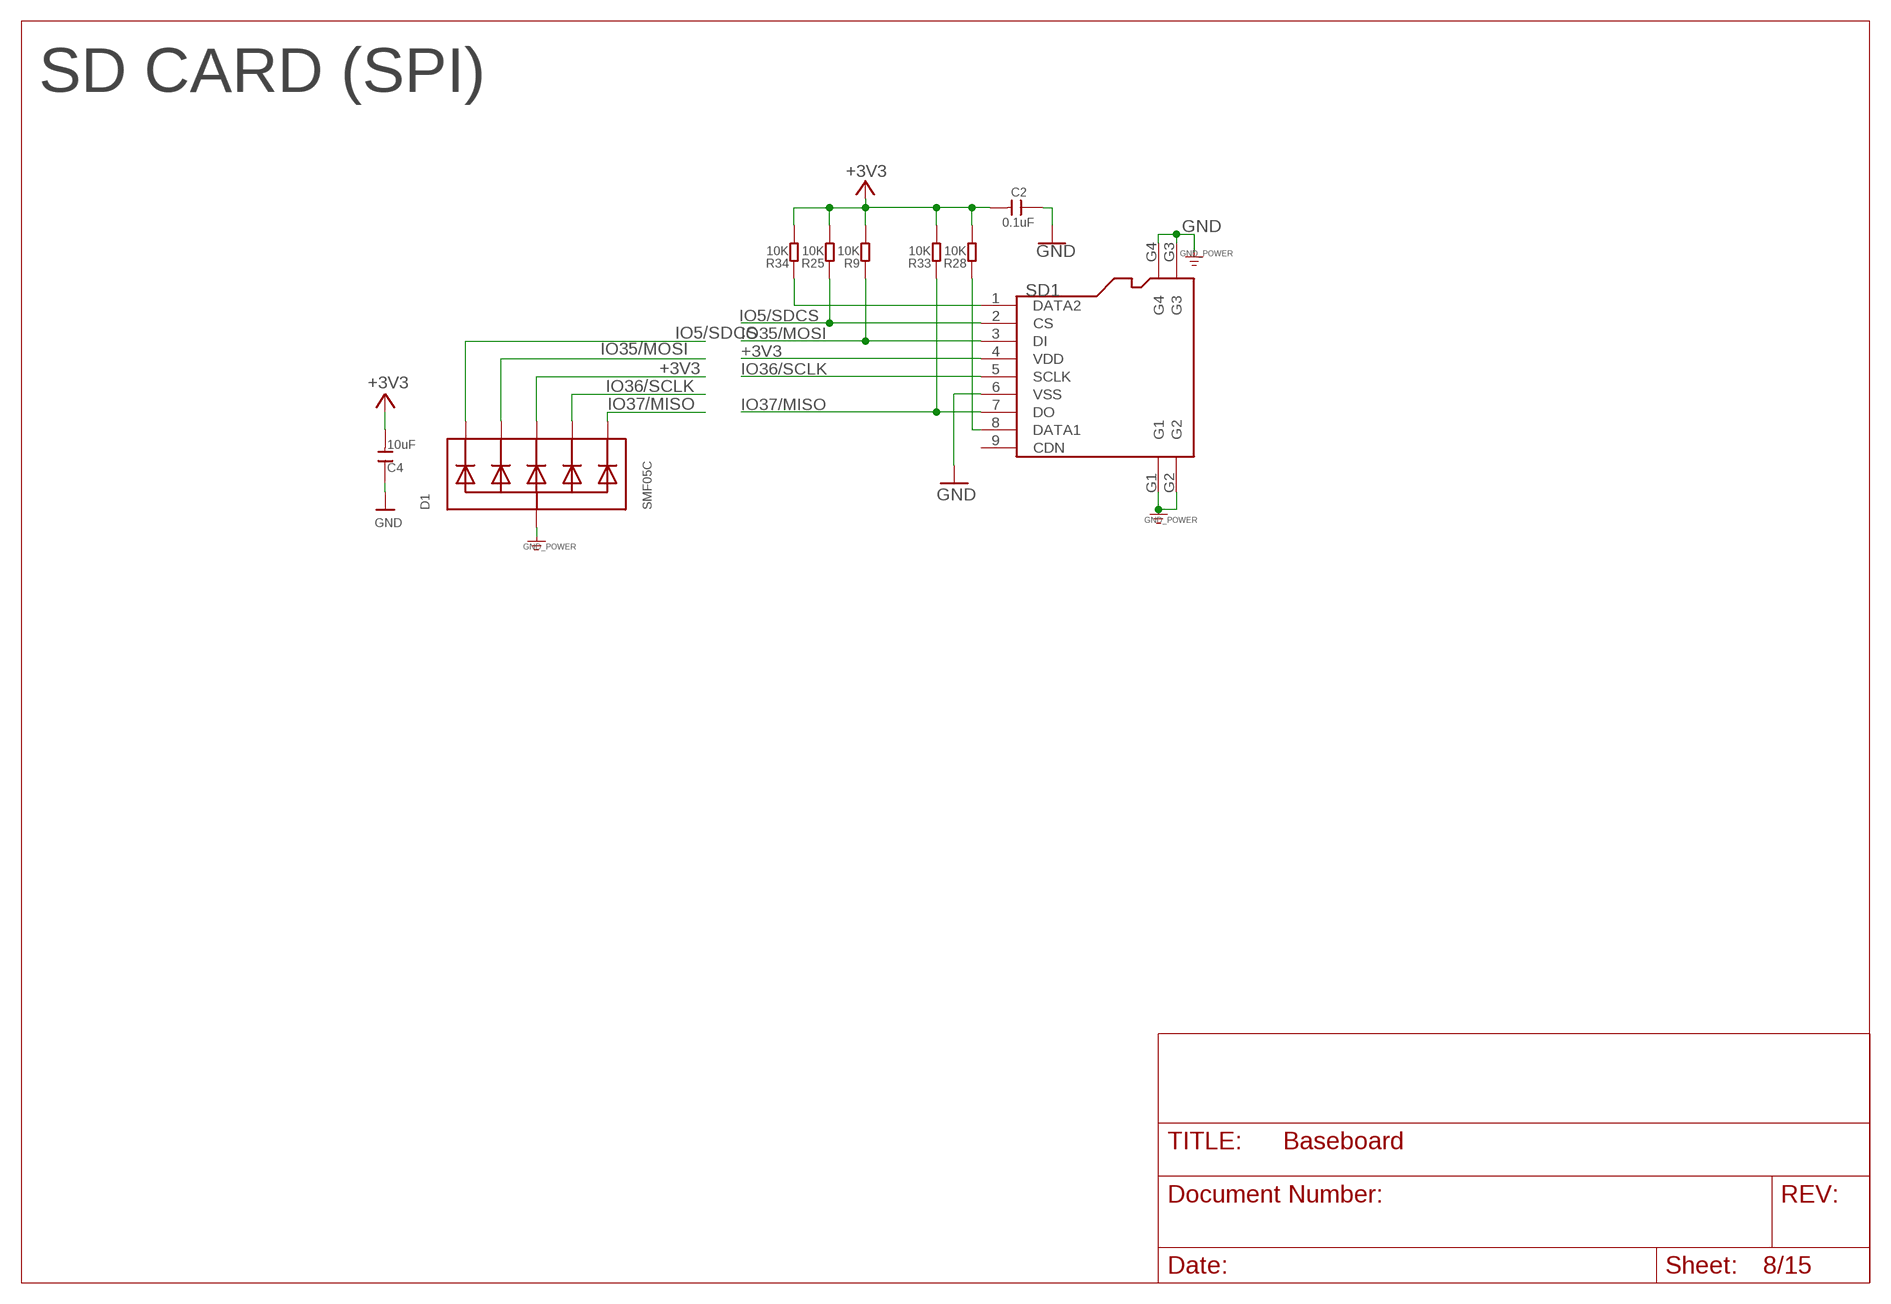
[diagram p7: schematic, sheet 8]

### Parts
C2  0.1uF  DISCRETE_C-0603  [DISCRETE_C0603]
C4  10uF  DISCRETE_C-1206  [DISCRETE_C1206]
D1  SMF05C  TVSARRAY_5LANE  [SOT363]
R9  10K  DISCRETE_R-0603  [DISCRETE_R0603]
R25  10K  DISCRETE_R-0603  [DISCRETE_R0603]
R28  10K  DISCRETE_R-0603  [DISCRETE_R0603]
R33  10K  DISCRETE_R-0603  [DISCRETE_R0603]
R34  10K  DISCRETE_R-0603  [DISCRETE_R0603]
SD1  HOLDER-MICROSD-9P  [9P-SMD-W/-RING]

### Nets
+3V3: C2.2 C4.2 D1.4(C3) R9.2 R25.2 R28.2 R33.2 R34.2 SD1.4(VDD) ; also sheet 1,2,6,7,9,10,11
GND: C2.1 C4.1 D1.2(A) SD1.6(VSS) SD1.G1 SD1.G2 SD1.G3 SD1.G4 ; supply symbol labelled GND_POWER ; also sheet 1,2,3,4,5,6,7,9,10,11,12,13,14,15
IO5/SDCS: D1.1(C1) R25.1 SD1.2(CS) ; also sheet 1
IO35/MOSI: D1.3(C2) R9.1 SD1.3(DI) ; also sheet 1,3,7,9
IO36/SCLK: D1.5(C4) SD1.5(SCLK) ; also sheet 1,3,6,7,9
IO37/MISO: D1.6(C5) R33.1 SD1.7(DO) ; also sheet 1,3,6,7,9
N$47: R34.1 SD1.1(DATA2)
N$48: R28.1 SD1.8(DATA1)
Unconnected: SD1.9(CDN)

### Notes on the sheet
- SD CARD (SPI)

## Sheet 9 of 15
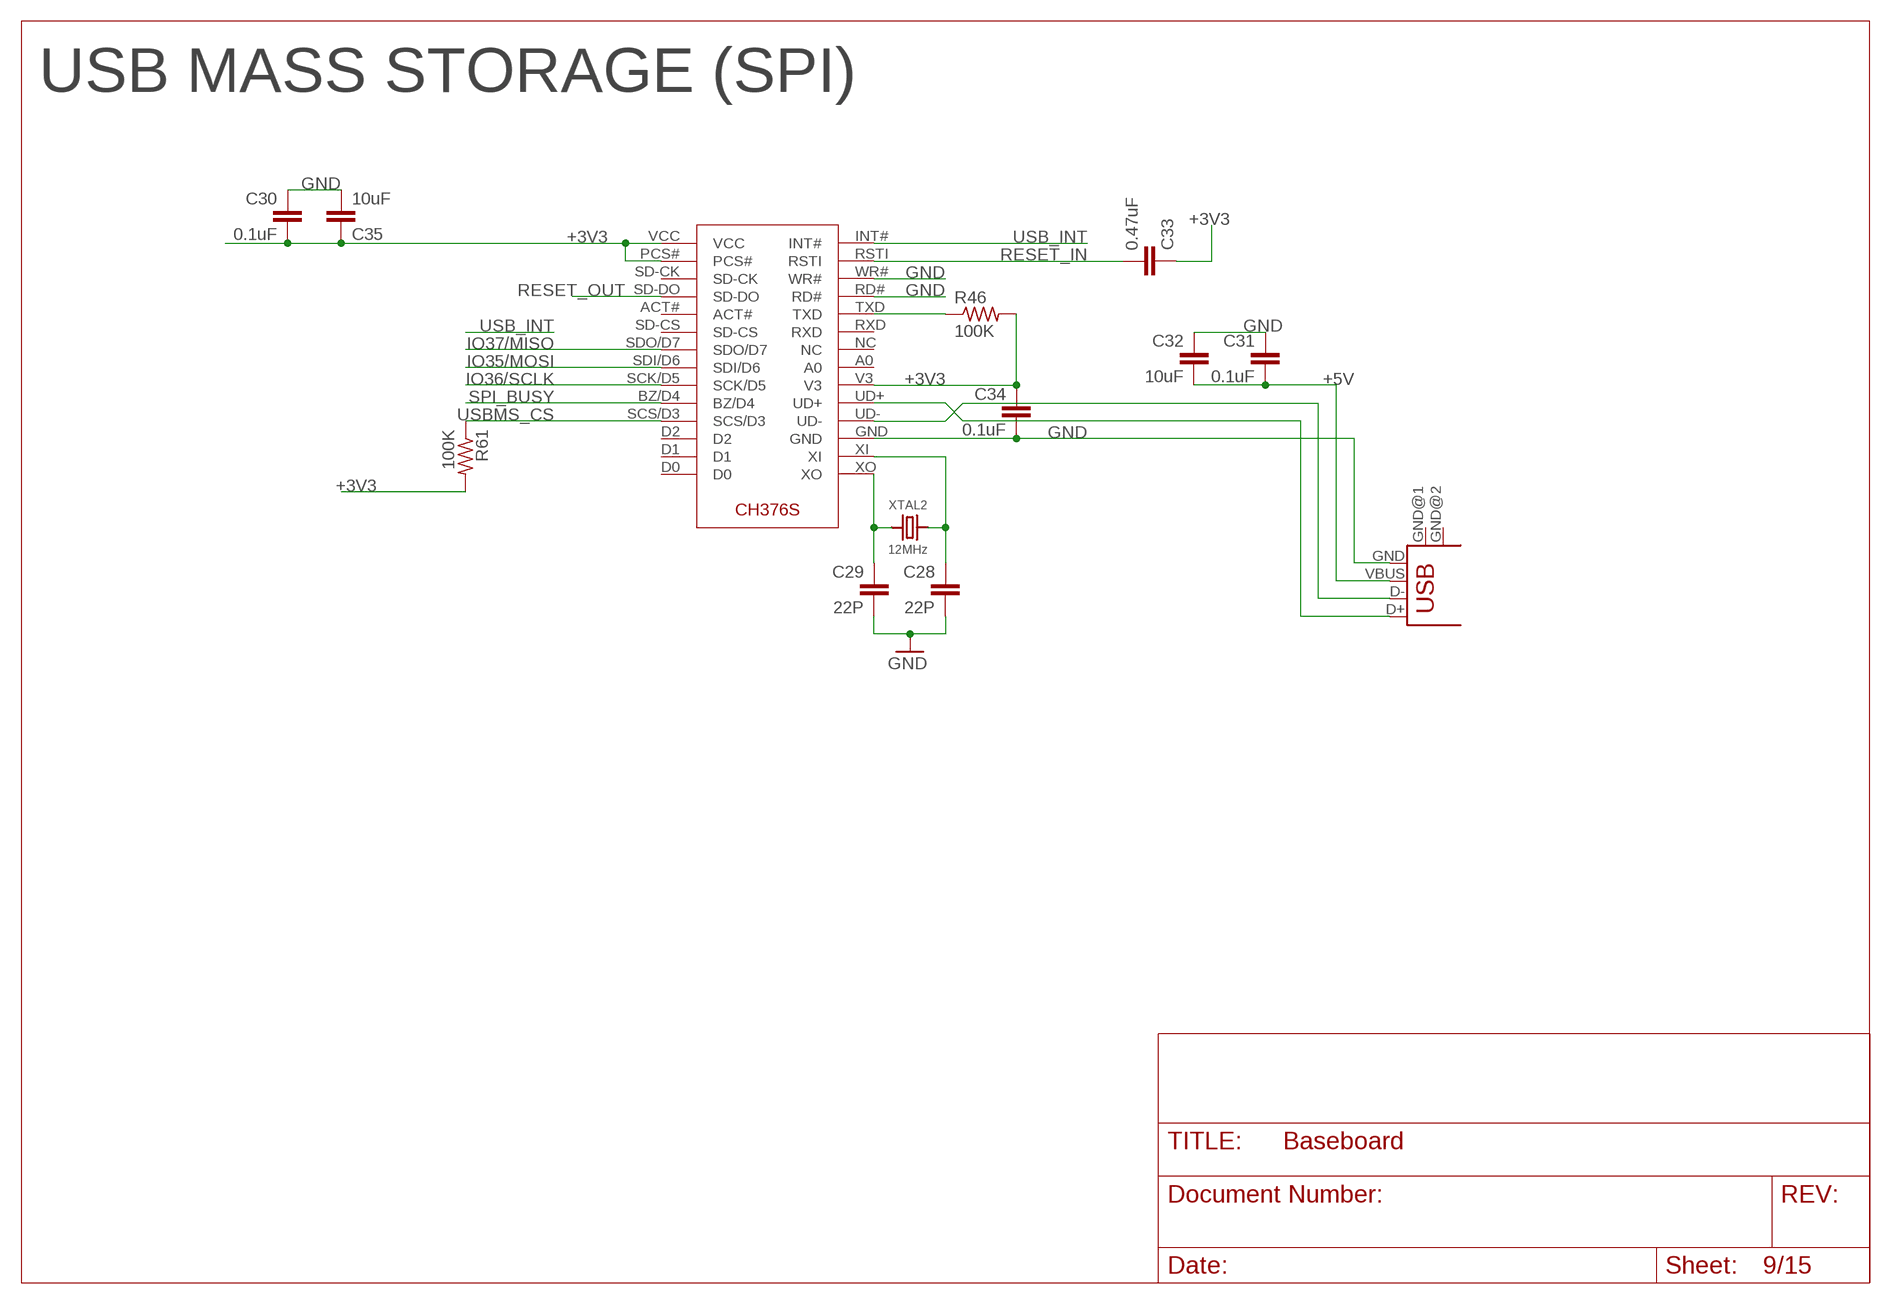
[diagram p8: schematic, sheet 9]

### Parts
C28  22P  C-EUC0603  [C0603]
C29  22P  C-EUC0603  [C0603]
C30  0.1uF  C-EUC0603  [C0603]
C31  0.1uF  C-EUC0603  [C0603]
C32  10uF  C-EUC1206  [C1206]
C33  0.47uF  C-EUC0603  [C0603]
C34  0.1uF  C-EUC0603  [C0603]
C35  10uF  C-EUC1206  [C1206]
IC2  CH376  [CH376S-SOIC]
R46  100K  R-US_R0603  [R0603]
R61  100K  R-US_R0603  [R0603]
USB1  USB-A-H  [USB-A-H]
XTAL2  12MHz  CRYSTALTHIN  [CRYSTAL_3.2X2.5]

### Nets
+3V3: C30.2 C33.1 C34.1 C35.1 IC2.PCS# IC2.V3 IC2.VCC R46.2 R61.2 ; also sheet 1,2,6,7,8,10,11
+5V: C31.2 C32.2 USB1.VBUS ; also sheet 2,3,4,5
GND: C28.2 C29.2 C30.1 C31.1 C32.1 C34.2 C35.2 IC2.GND IC2.RD# IC2.WR# USB1.GND ; also sheet 1,2,3,4,5,6,7,8,10,11,12,13,14,15
IO35/MOSI: IC2.SDI/D6 ; also sheet 1,3,7,8
IO36/SCLK: IC2.SCK/D5 ; also sheet 1,3,6,7,8
IO37/MISO: IC2.SDO/D7 ; also sheet 1,3,6,7,8
N$29: IC2.UD+ USB1.D+
N$30: IC2.UD- USB1.D-
N$31: C28.1 IC2.XI XTAL2.1
N$32: C29.1 IC2.XO XTAL2.2
N$38: IC2.TXD R46.1
RESET_IN: C33.2 IC2.RSTI
RESET_OUT: IC2.SD-DO
SPI_BUSY: IC2.BZ/D4
USB_INT: IC2.INT# ; also sheet 1
USBMS_CS: IC2.SCS/D3 R61.1 ; also sheet 1
Unconnected: IC2.A0 IC2.ACT# IC2.D0 IC2.D1 IC2.D2 IC2.NC IC2.RXD IC2.SD-CK IC2.SD-CS USB1.GND@1(GND) USB1.GND@2(GND)

### Notes on the sheet
- USB MASS STORAGE (SPI)

## Sheet 10 of 15
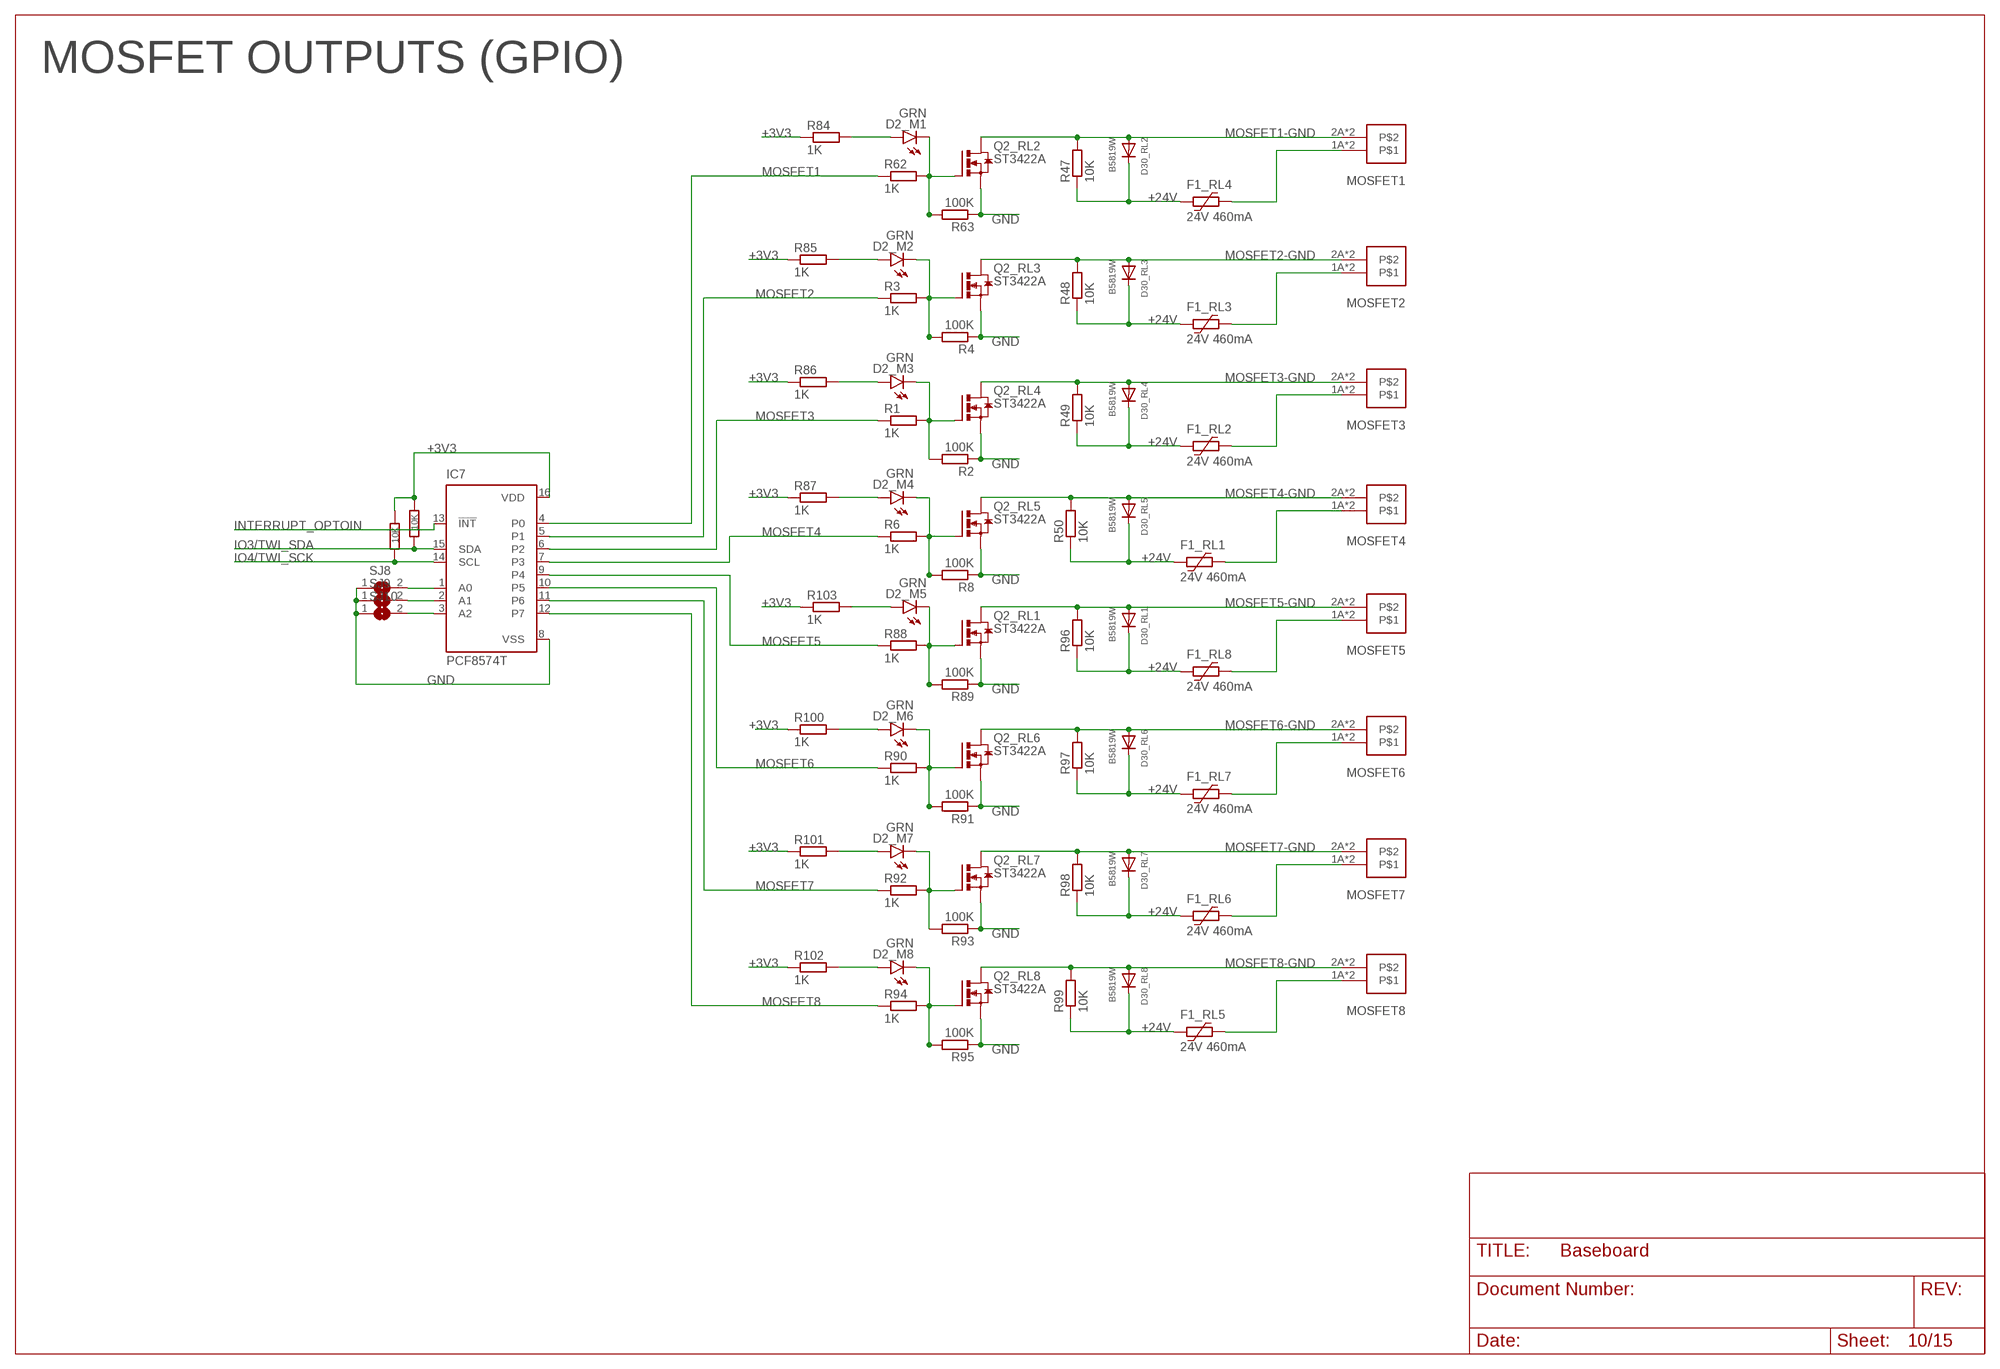
[diagram p9: schematic, sheet 10]

### Parts
D2_M1  GRN  LEDCHIP-LED0603  [CHIP-LED0603]
D2_M2  GRN  LEDCHIP-LED0603  [CHIP-LED0603]
D2_M3  GRN  LEDCHIP-LED0603  [CHIP-LED0603]
D2_M4  GRN  LEDCHIP-LED0603  [CHIP-LED0603]
D2_M5  GRN  LEDCHIP-LED0603  [CHIP-LED0603]
D2_M6  GRN  LEDCHIP-LED0603  [CHIP-LED0603]
D2_M7  GRN  LEDCHIP-LED0603  [CHIP-LED0603]
D2_M8  GRN  LEDCHIP-LED0603  [CHIP-LED0603]
D30_RL1  B5819W  [SOD123FL]
D30_RL2  B5819W  [SOD123FL]
D30_RL3  B5819W  [SOD123FL]
D30_RL4  B5819W  [SOD123FL]
D30_RL5  B5819W  [SOD123FL]
D30_RL6  B5819W  [SOD123FL]
D30_RL7  B5819W  [SOD123FL]
D30_RL8  B5819W  [SOD123FL]
F1_RL1  24V 460mA  1206L050  [1206L]
F1_RL2  24V 460mA  1206L050  [1206L]
F1_RL3  24V 460mA  1206L050  [1206L]
F1_RL4  24V 460mA  1206L050  [1206L]
F1_RL5  24V 460mA  1206L050  [1206L]
F1_RL6  24V 460mA  1206L050  [1206L]
F1_RL7  24V 460mA  1206L050  [1206L]
F1_RL8  24V 460mA  1206L050  [1206L]
IC7  PCF8574T  [SO16W]
MOSFET1  WJ212R-THR-3.5-2  [WJ212R-THR-3.5-2]
MOSFET2  WJ212R-THR-3.5-2  [WJ212R-THR-3.5-2]
MOSFET3  WJ212R-THR-3.5-2  [WJ212R-THR-3.5-2]
MOSFET4  WJ212R-THR-3.5-2  [WJ212R-THR-3.5-2]
MOSFET5  WJ212R-THR-3.5-2  [WJ212R-THR-3.5-2]
MOSFET6  WJ212R-THR-3.5-2  [WJ212R-THR-3.5-2]
MOSFET7  WJ212R-THR-3.5-2  [WJ212R-THR-3.5-2]
MOSFET8  WJ212R-THR-3.5-2  [WJ212R-THR-3.5-2]
Q2_RL1  ST3422A  [SOT-23]
Q2_RL2  ST3422A  [SOT-23]
Q2_RL3  ST3422A  [SOT-23]
Q2_RL4  ST3422A  [SOT-23]
Q2_RL5  ST3422A  [SOT-23]
Q2_RL6  ST3422A  [SOT-23]
Q2_RL7  ST3422A  [SOT-23]
Q2_RL8  ST3422A  [SOT-23]
R1  1K  R-EU_R0603  [R0603]
R2  100K  R-EU_R0603  [R0603]
R3  1K  R-EU_R0603  [R0603]
R4  100K  R-EU_R0603  [R0603]
R6  1K  R-EU_R0603  [R0603]
R8  100K  R-EU_R0603  [R0603]
R47  10K  R-EU_R0603  [R0603]
R48  10K  R-EU_R0603  [R0603]
R49  10K  R-EU_R0603  [R0603]
R50  10K  R-EU_R0603  [R0603]
R62  1K  R-EU_R0603  [R0603]
R63  100K  R-EU_R0603  [R0603]
R82  10K  R-EU_R0603  [R0603]
R83  10K  R-EU_R0603  [R0603]
R84  1K  R-EU_R0603  [R0603]
R85  1K  R-EU_R0603  [R0603]
R86  1K  R-EU_R0603  [R0603]
R87  1K  R-EU_R0603  [R0603]
R88  1K  R-EU_R0603  [R0603]
R89  100K  R-EU_R0603  [R0603]
R90  1K  R-EU_R0603  [R0603]
R91  100K  R-EU_R0603  [R0603]
R92  1K  R-EU_R0603  [R0603]
R93  100K  R-EU_R0603  [R0603]
R94  1K  R-EU_R0603  [R0603]
R95  100K  R-EU_R0603  [R0603]
R96  10K  R-EU_R0603  [R0603]
R97  10K  R-EU_R0603  [R0603]
R98  10K  R-EU_R0603  [R0603]
R99  10K  R-EU_R0603  [R0603]
R100  1K  R-EU_R0603  [R0603]
R101  1K  R-EU_R0603  [R0603]
R102  1K  R-EU_R0603  [R0603]
R103  1K  R-EU_R0603  [R0603]
SJ8  SJ  [SJ]
SJ9  SJ  [SJ]
SJ10  SJ  [SJ]

### Nets
+3V3: IC7.16(VDD) R82.2 R83.2 R84.1 R85.1 R86.1 R87.1 R100.1 R101.1 R102.1 R103.1 ; also sheet 1,2,6,7,8,9,11
+24V: D30_RL1.C D30_RL2.C D30_RL3.C D30_RL4.C D30_RL5.C D30_RL6.C D30_RL7.C D30_RL8.C F1_RL1.2 F1_RL2.2 F1_RL3.2 F1_RL4.2 F1_RL5.2 F1_RL6.2 F1_RL7.2 F1_RL8.2 R47.1 R48.1 R49.1 R50.1 R96.1 R97.1 R98.1 R99.1 ; also sheet 2,5
GND: IC7.8(VSS) Q2_RL1.P2(S) Q2_RL2.P2(S) Q2_RL3.P2(S) Q2_RL4.P2(S) Q2_RL5.P2(S) Q2_RL6.P2(S) Q2_RL7.P2(S) Q2_RL8.P2(S) R2.1 R4.1 R8.1 R63.1 R89.1 R91.1 R93.1 R95.1 SJ8.1 SJ9.1 SJ10.1 ; also sheet 1,2,3,4,5,6,7,8,9,11,12,13,14,15
INTERRUPT_OPTOIN: IC7.13(!INT) ; also sheet 11
IO3/TWI_SDA: IC7.15(SDA) R82.1 ; also sheet 1,3,4,5,11
IO4/TWI_SCK: IC7.14(SCL) R83.1 ; also sheet 1,3,4,5,11
MOSFET1: IC7.4(P0) R62.1 ; also sheet 1
MOSFET1-GND: D30_RL2.A MOSFET1.2A MOSFET1.2B Q2_RL2.P3(D) R47.2
MOSFET2: IC7.5(P1) R3.1 ; also sheet 1
MOSFET2-GND: D30_RL3.A MOSFET2.2A MOSFET2.2B Q2_RL3.P3(D) R48.2
MOSFET3: IC7.6(P2) R1.1 ; also sheet 1
MOSFET3-GND: D30_RL4.A MOSFET3.2A MOSFET3.2B Q2_RL4.P3(D) R49.2
MOSFET4: IC7.7(P3) R6.1 ; also sheet 1
MOSFET4-GND: D30_RL5.A MOSFET4.2A MOSFET4.2B Q2_RL5.P3(D) R50.2
MOSFET5: IC7.9(P4) R88.1
MOSFET5-GND: D30_RL1.A MOSFET5.2A MOSFET5.2B Q2_RL1.P3(D) R96.2
MOSFET6: IC7.10(P5) R90.1
MOSFET6-GND: D30_RL6.A MOSFET6.2A MOSFET6.2B Q2_RL6.P3(D) R97.2
MOSFET7: IC7.11(P6) R92.1
MOSFET7-GND: D30_RL7.A MOSFET7.2A MOSFET7.2B Q2_RL7.P3(D) R98.2
MOSFET8: IC7.12(P7) R94.1
MOSFET8-GND: D30_RL8.A MOSFET8.2A MOSFET8.2B Q2_RL8.P3(D) R99.2
N$1: D2_M3.C Q2_RL4.P1(G) R1.2 R2.2
N$2: D2_M2.C Q2_RL3.P1(G) R3.2 R4.2
N$3: D2_M4.C Q2_RL5.P1(G) R6.2 R8.2
N$13: D2_M1.C Q2_RL2.P1(G) R62.2 R63.2
N$41: D2_M1.A R84.2
N$42: F1_RL3.1 MOSFET2.1A MOSFET2.1B
N$43: F1_RL2.1 MOSFET3.1A MOSFET3.1B
N$44: F1_RL1.1 MOSFET4.1A MOSFET4.1B
N$72: IC7.1(A0) SJ8.2
N$73: IC7.2(A1) SJ9.2
N$74: IC7.3(A2) SJ10.2
N$75: D2_M5.C Q2_RL1.P1(G) R88.2 R89.2
N$76: D2_M2.A R85.2
N$77: D2_M3.A R86.2
N$79: D2_M4.A R87.2
N$80: F1_RL4.1 MOSFET1.1A MOSFET1.1B
N$81: D2_M6.C Q2_RL6.P1(G) R90.2 R91.2
N$82: D2_M7.C Q2_RL7.P1(G) R92.2 R93.2
N$83: D2_M8.C Q2_RL8.P1(G) R94.2 R95.2
N$84: F1_RL7.1 MOSFET6.1A MOSFET6.1B
N$85: F1_RL6.1 MOSFET7.1A MOSFET7.1B
N$86: F1_RL5.1 MOSFET8.1A MOSFET8.1B
N$87: D2_M6.A R100.2
N$88: D2_M7.A R101.2
N$89: D2_M8.A R102.2
N$90: F1_RL8.1 MOSFET5.1A MOSFET5.1B
N$91: D2_M5.A R103.2

### Notes on the sheet
- MOSFET OUTPUTS (GPIO)

## Sheet 11 of 15
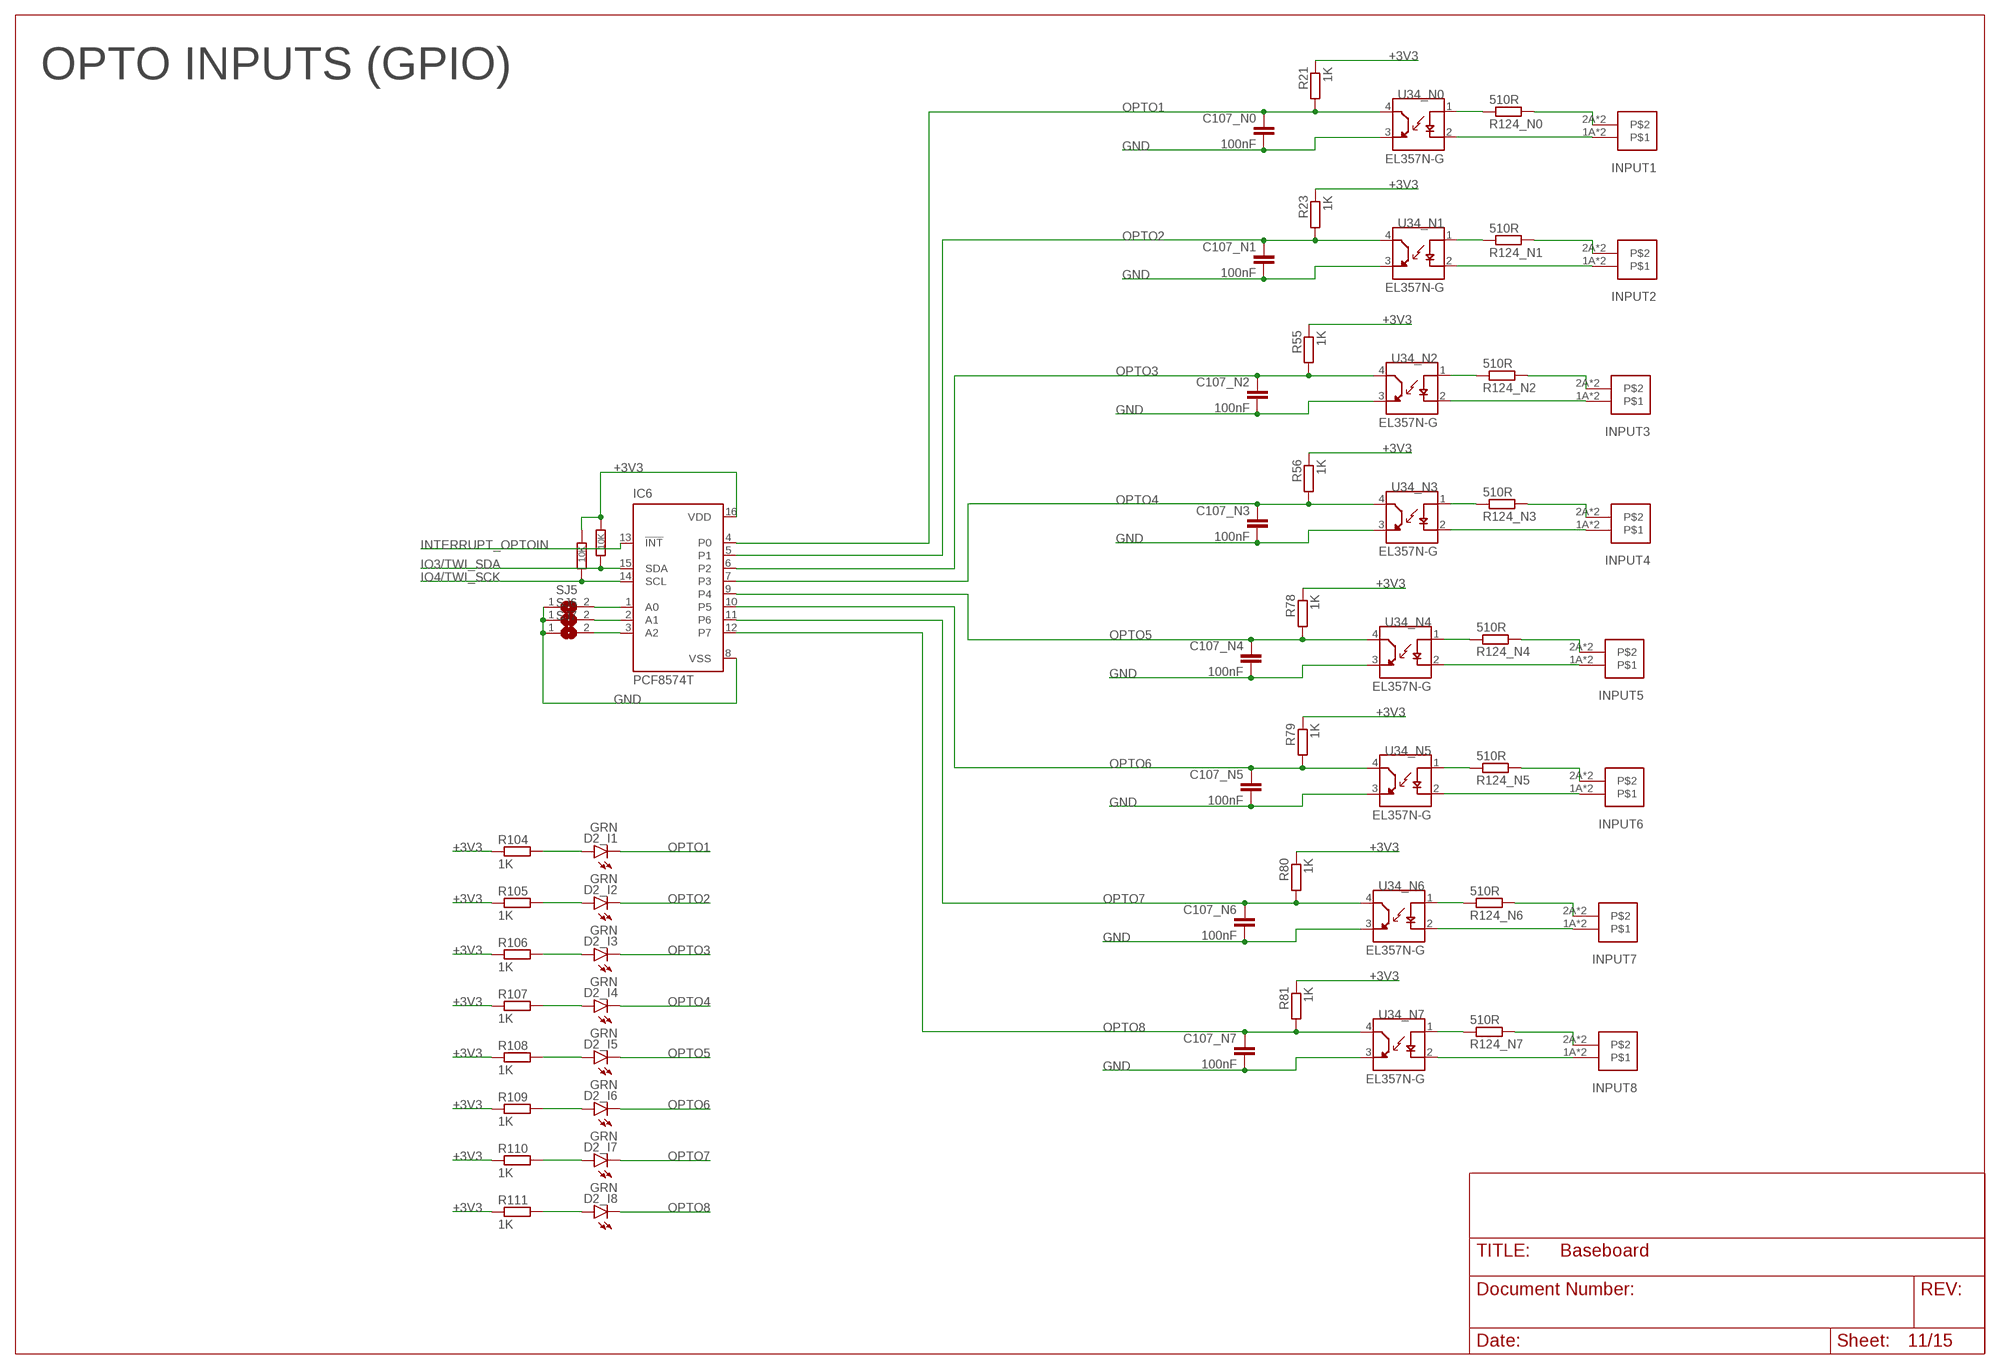
[diagram p10: schematic, sheet 11]

### Parts
C107_N0  100nF  C-EUC0402  [C0402]
C107_N1  100nF  C-EUC0402  [C0402]
C107_N2  100nF  C-EUC0402  [C0402]
C107_N3  100nF  C-EUC0402  [C0402]
C107_N4  100nF  C-EUC0402  [C0402]
C107_N5  100nF  C-EUC0402  [C0402]
C107_N6  100nF  C-EUC0402  [C0402]
C107_N7  100nF  C-EUC0402  [C0402]
D2_I1  GRN  LEDCHIP-LED0603  [CHIP-LED0603]
D2_I2  GRN  LEDCHIP-LED0603  [CHIP-LED0603]
D2_I3  GRN  LEDCHIP-LED0603  [CHIP-LED0603]
D2_I4  GRN  LEDCHIP-LED0603  [CHIP-LED0603]
D2_I5  GRN  LEDCHIP-LED0603  [CHIP-LED0603]
D2_I6  GRN  LEDCHIP-LED0603  [CHIP-LED0603]
D2_I7  GRN  LEDCHIP-LED0603  [CHIP-LED0603]
D2_I8  GRN  LEDCHIP-LED0603  [CHIP-LED0603]
IC6  PCF8574T  [SO16W]
INPUT1  WJ212R-THR-3.5-2  [WJ212R-THR-3.5-2]
INPUT2  WJ212R-THR-3.5-2  [WJ212R-THR-3.5-2]
INPUT3  WJ212R-THR-3.5-2  [WJ212R-THR-3.5-2]
INPUT4  WJ212R-THR-3.5-2  [WJ212R-THR-3.5-2]
INPUT5  WJ212R-THR-3.5-2  [WJ212R-THR-3.5-2]
INPUT6  WJ212R-THR-3.5-2  [WJ212R-THR-3.5-2]
INPUT7  WJ212R-THR-3.5-2  [WJ212R-THR-3.5-2]
INPUT8  WJ212R-THR-3.5-2  [WJ212R-THR-3.5-2]
R21  1K  R-EU_R0603  [R0603]
R23  1K  R-EU_R0603  [R0603]
R55  1K  R-EU_R0603  [R0603]
R56  1K  R-EU_R0603  [R0603]
R76  10K  R-EU_R0603  [R0603]
R77  10K  R-EU_R0603  [R0603]
R78  1K  R-EU_R0603  [R0603]
R79  1K  R-EU_R0603  [R0603]
R80  1K  R-EU_R0603  [R0603]
R81  1K  R-EU_R0603  [R0603]
R104  1K  R-EU_R0603  [R0603]
R105  1K  R-EU_R0603  [R0603]
R106  1K  R-EU_R0603  [R0603]
R107  1K  R-EU_R0603  [R0603]
R108  1K  R-EU_R0603  [R0603]
R109  1K  R-EU_R0603  [R0603]
R110  1K  R-EU_R0603  [R0603]
R111  1K  R-EU_R0603  [R0603]
R124_N0  510R  R-EU_R0402  [R0402]
R124_N1  510R  R-EU_R0402  [R0402]
R124_N2  510R  R-EU_R0402  [R0402]
R124_N3  510R  R-EU_R0402  [R0402]
R124_N4  510R  R-EU_R0402  [R0402]
R124_N5  510R  R-EU_R0402  [R0402]
R124_N6  510R  R-EU_R0402  [R0402]
R124_N7  510R  R-EU_R0402  [R0402]
SJ5  SJ  [SJ]
SJ6  SJ  [SJ]
SJ7  SJ  [SJ]
U34_N0  EL357N-G  [OPTO_EL357N-G]
U34_N1  EL357N-G  [OPTO_EL357N-G]
U34_N2  EL357N-G  [OPTO_EL357N-G]
U34_N3  EL357N-G  [OPTO_EL357N-G]
U34_N4  EL357N-G  [OPTO_EL357N-G]
U34_N5  EL357N-G  [OPTO_EL357N-G]
U34_N6  EL357N-G  [OPTO_EL357N-G]
U34_N7  EL357N-G  [OPTO_EL357N-G]

### Nets
+3V3: IC6.16(VDD) R21.1 R23.1 R55.1 R56.1 R76.2 R77.2 R78.1 R79.1 R80.1 R81.1 R104.1 R105.1 R106.1 R107.1 R108.1 R109.1 R110.1 R111.1 ; also sheet 1,2,6,7,8,9,10
GND: C107_N0.2 C107_N1.2 C107_N2.2 C107_N3.2 C107_N4.2 C107_N5.2 C107_N6.2 C107_N7.2 IC6.8(VSS) SJ5.1 SJ6.1 SJ7.1 U34_N0.3(ET) U34_N1.3(ET) U34_N2.3(ET) U34_N3.3(ET) U34_N4.3(ET) U34_N5.3(ET) U34_N6.3(ET) U34_N7.3(ET) ; also sheet 1,2,3,4,5,6,7,8,9,10,12,13,14,15
INTERRUPT_OPTOIN: IC6.13(!INT) ; also sheet 10
IO3/TWI_SDA: IC6.15(SDA) R76.1 ; also sheet 1,3,4,5,10
IO4/TWI_SCK: IC6.14(SCL) R77.1 ; also sheet 1,3,4,5,10
N$45: R124_N1.1 U34_N1.1(A)
N$46: R124_N2.1 U34_N2.1(A)
N$49: R124_N3.1 U34_N3.1(A)
N$50: INPUT1.2A INPUT1.2B R124_N0.2
N$51: INPUT2.2A INPUT2.2B R124_N1.2
N$52: INPUT3.2A INPUT3.2B R124_N2.2
N$53: INPUT4.2A INPUT4.2B R124_N3.2
N$59: IC6.1(A0) SJ5.2
N$60: IC6.2(A1) SJ6.2
N$62: IC6.3(A2) SJ7.2
N$63: R124_N4.1 U34_N4.1(A)
N$64: R124_N5.1 U34_N5.1(A)
N$65: R124_N6.1 U34_N6.1(A)
N$66: R124_N7.1 U34_N7.1(A)
N$67: INPUT5.2A INPUT5.2B R124_N4.2
N$68: INPUT6.2A INPUT6.2B R124_N5.2
N$69: R124_N0.1 U34_N0.1(A)
N$70: INPUT7.2A INPUT7.2B R124_N6.2
N$71: INPUT8.2A INPUT8.2B R124_N7.2
N$92: D2_I1.A R104.2
N$93: D2_I2.A R105.2
N$94: D2_I3.A R106.2
N$95: D2_I4.A R107.2
N$96: D2_I5.A R108.2
N$97: D2_I6.A R109.2
N$98: D2_I7.A R110.2
N$99: D2_I8.A R111.2
N$100: INPUT8.1A INPUT8.1B U34_N7.2(C)
N$101: INPUT7.1A INPUT7.1B U34_N6.2(C)
N$102: INPUT6.1A INPUT6.1B U34_N5.2(C)
N$103: INPUT5.1A INPUT5.1B U34_N4.2(C)
N$104: INPUT4.1A INPUT4.1B U34_N3.2(C)
N$105: INPUT3.1A INPUT3.1B U34_N2.2(C)
N$106: INPUT2.1A INPUT2.1B U34_N1.2(C)
N$107: INPUT1.1A INPUT1.1B U34_N0.2(C)
OPTO1: C107_N0.1 D2_I1.C IC6.4(P0) R21.2 U34_N0.4(CT)
OPTO2: C107_N1.1 D2_I2.C IC6.5(P1) R23.2 U34_N1.4(CT)
OPTO3: C107_N2.1 D2_I3.C IC6.6(P2) R55.2 U34_N2.4(CT)
OPTO4: C107_N3.1 D2_I4.C IC6.7(P3) R56.2 U34_N3.4(CT)
OPTO5: C107_N4.1 D2_I5.C IC6.9(P4) R78.2 U34_N4.4(CT)
OPTO6: C107_N5.1 D2_I6.C IC6.10(P5) R79.2 U34_N5.4(CT)
OPTO7: C107_N6.1 D2_I7.C IC6.11(P6) R80.2 U34_N6.4(CT)
OPTO8: C107_N7.1 D2_I8.C IC6.12(P7) R81.2 U34_N7.4(CT)

### Notes on the sheet
- OPTO INPUTS (GPIO)

## Sheet 12 of 15
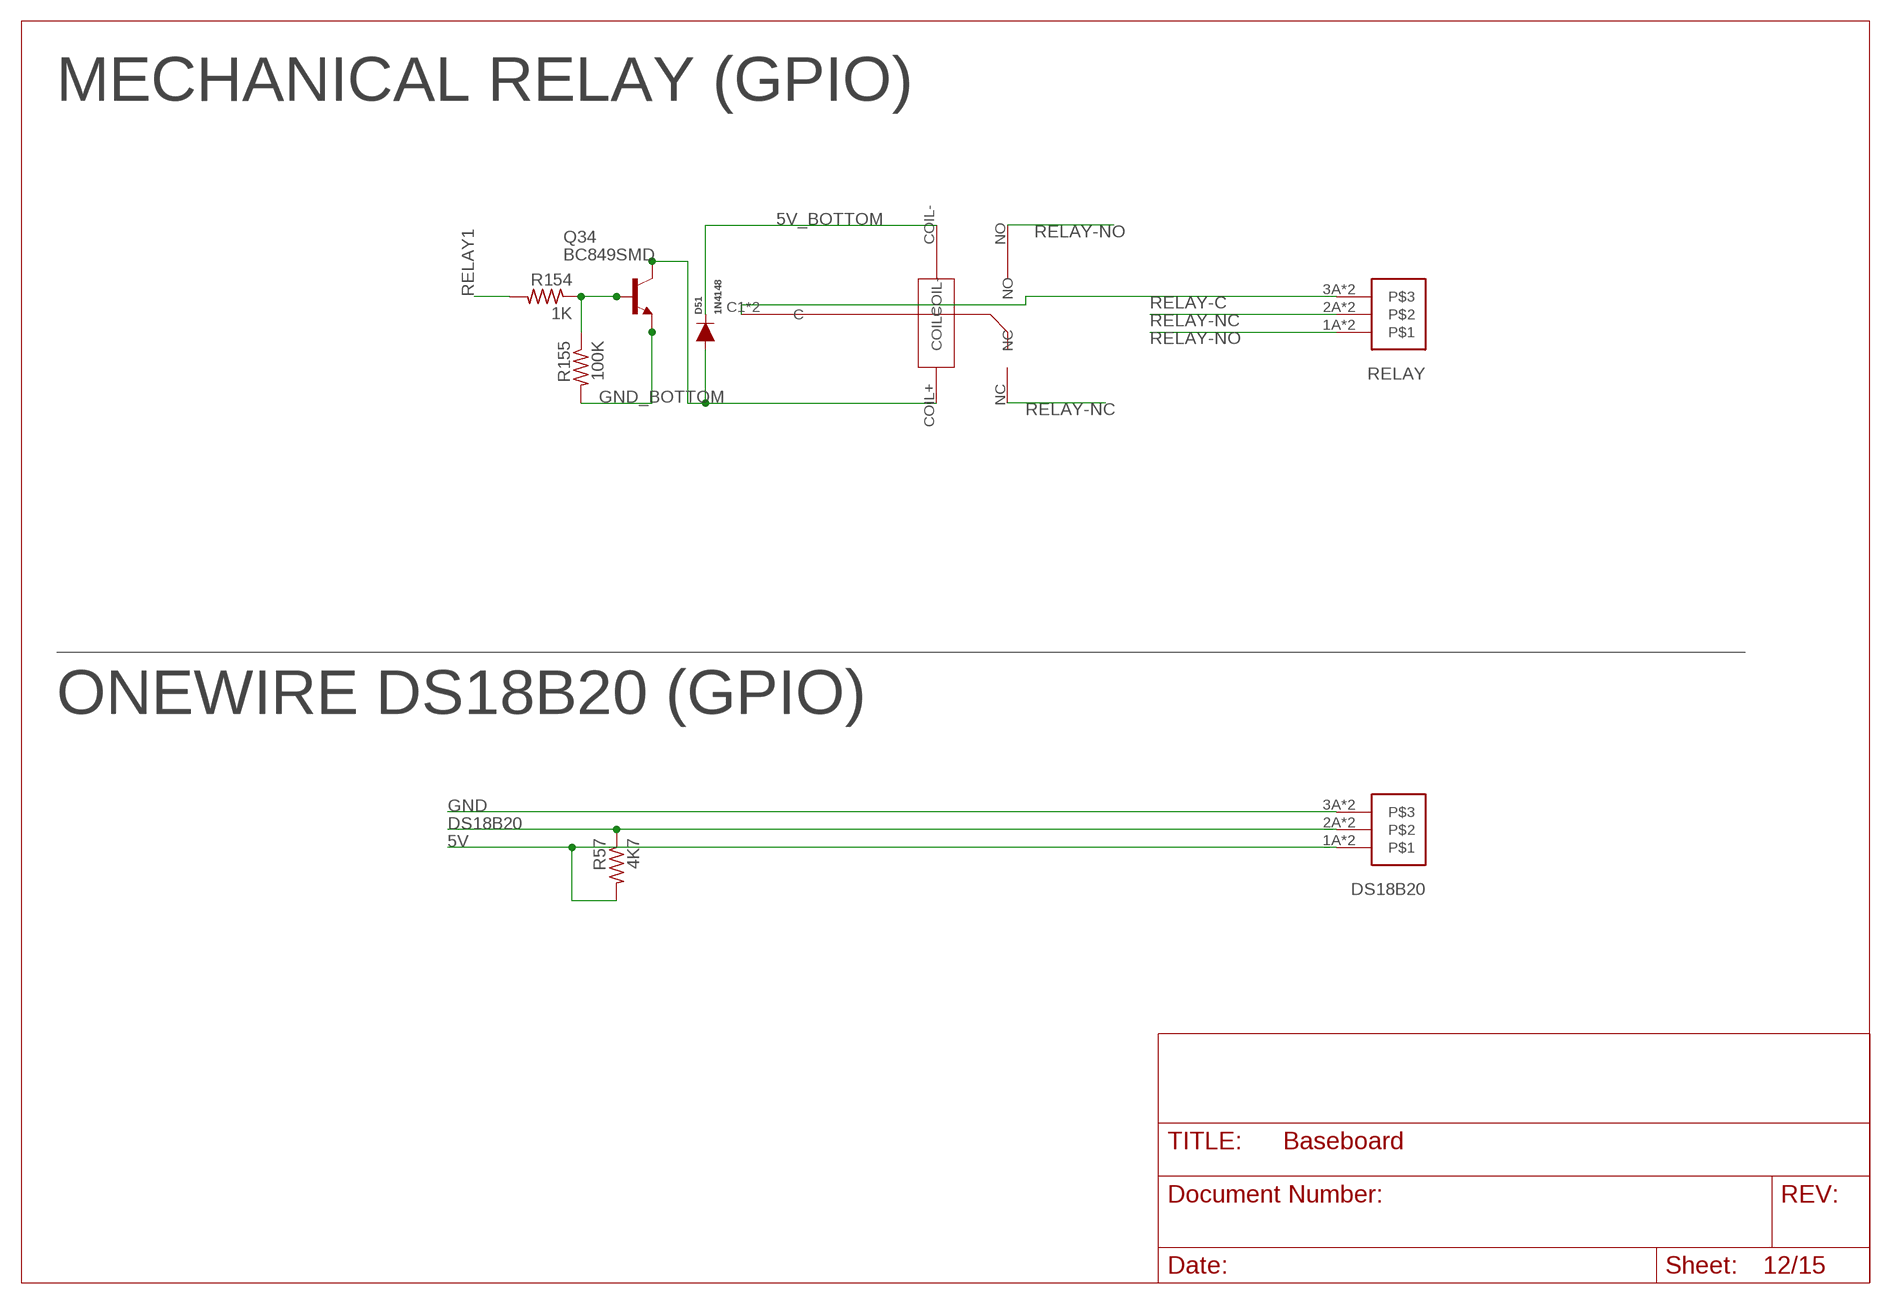
[diagram p11: schematic, sheet 12]

### Parts
D51  1N4148  DIODE-BAS16J  [SOD-323]
DS18B20  WJ212R-THR-3.5-3  [WJ212R-THR-3.5-3]
Q34  BC849SMD  [SOT23-BEC]
R57  4K7  R-US_R0603  [R0603]
R154  1K  R-US_R0603  [R0603]
R155  100K  R-US_R0603  [R0603]
RELAY  WJ212R-THR-3.5-3  [WJ212R-THR-3.5-3]
U$12  JRC-21F-4100  [JRC-21F-4100]

### Nets
5V: DS18B20.1A DS18B20.1B R57.2 ; also sheet 5
5V_BOTTOM: D51.C U$12.COIL-
COIL-1: D51.A Q34.C U$12.COIL+(COIL=)
DS18B20: DS18B20.2A DS18B20.2B R57.1 ; also sheet 1
GND: DS18B20.3A DS18B20.3B ; also sheet 1,2,3,4,5,6,7,8,9,10,11,13,14,15
GND_BOTTOM: Q34.E R155.2
N$78: Q34.B R154.1 R155.1
RELAY1: R154.2 ; also sheet 1
RELAY-C: RELAY.3A RELAY.3B U$12.C1(C) U$12.C2(C)
RELAY-NC: RELAY.2A RELAY.2B U$12.NC
RELAY-NO: RELAY.1A RELAY.1B U$12.NO

### Notes on the sheet
- MECHANICAL RELAY (GPIO)
- ONEWIRE DS18B20 (GPIO)

## Sheet 13 of 15
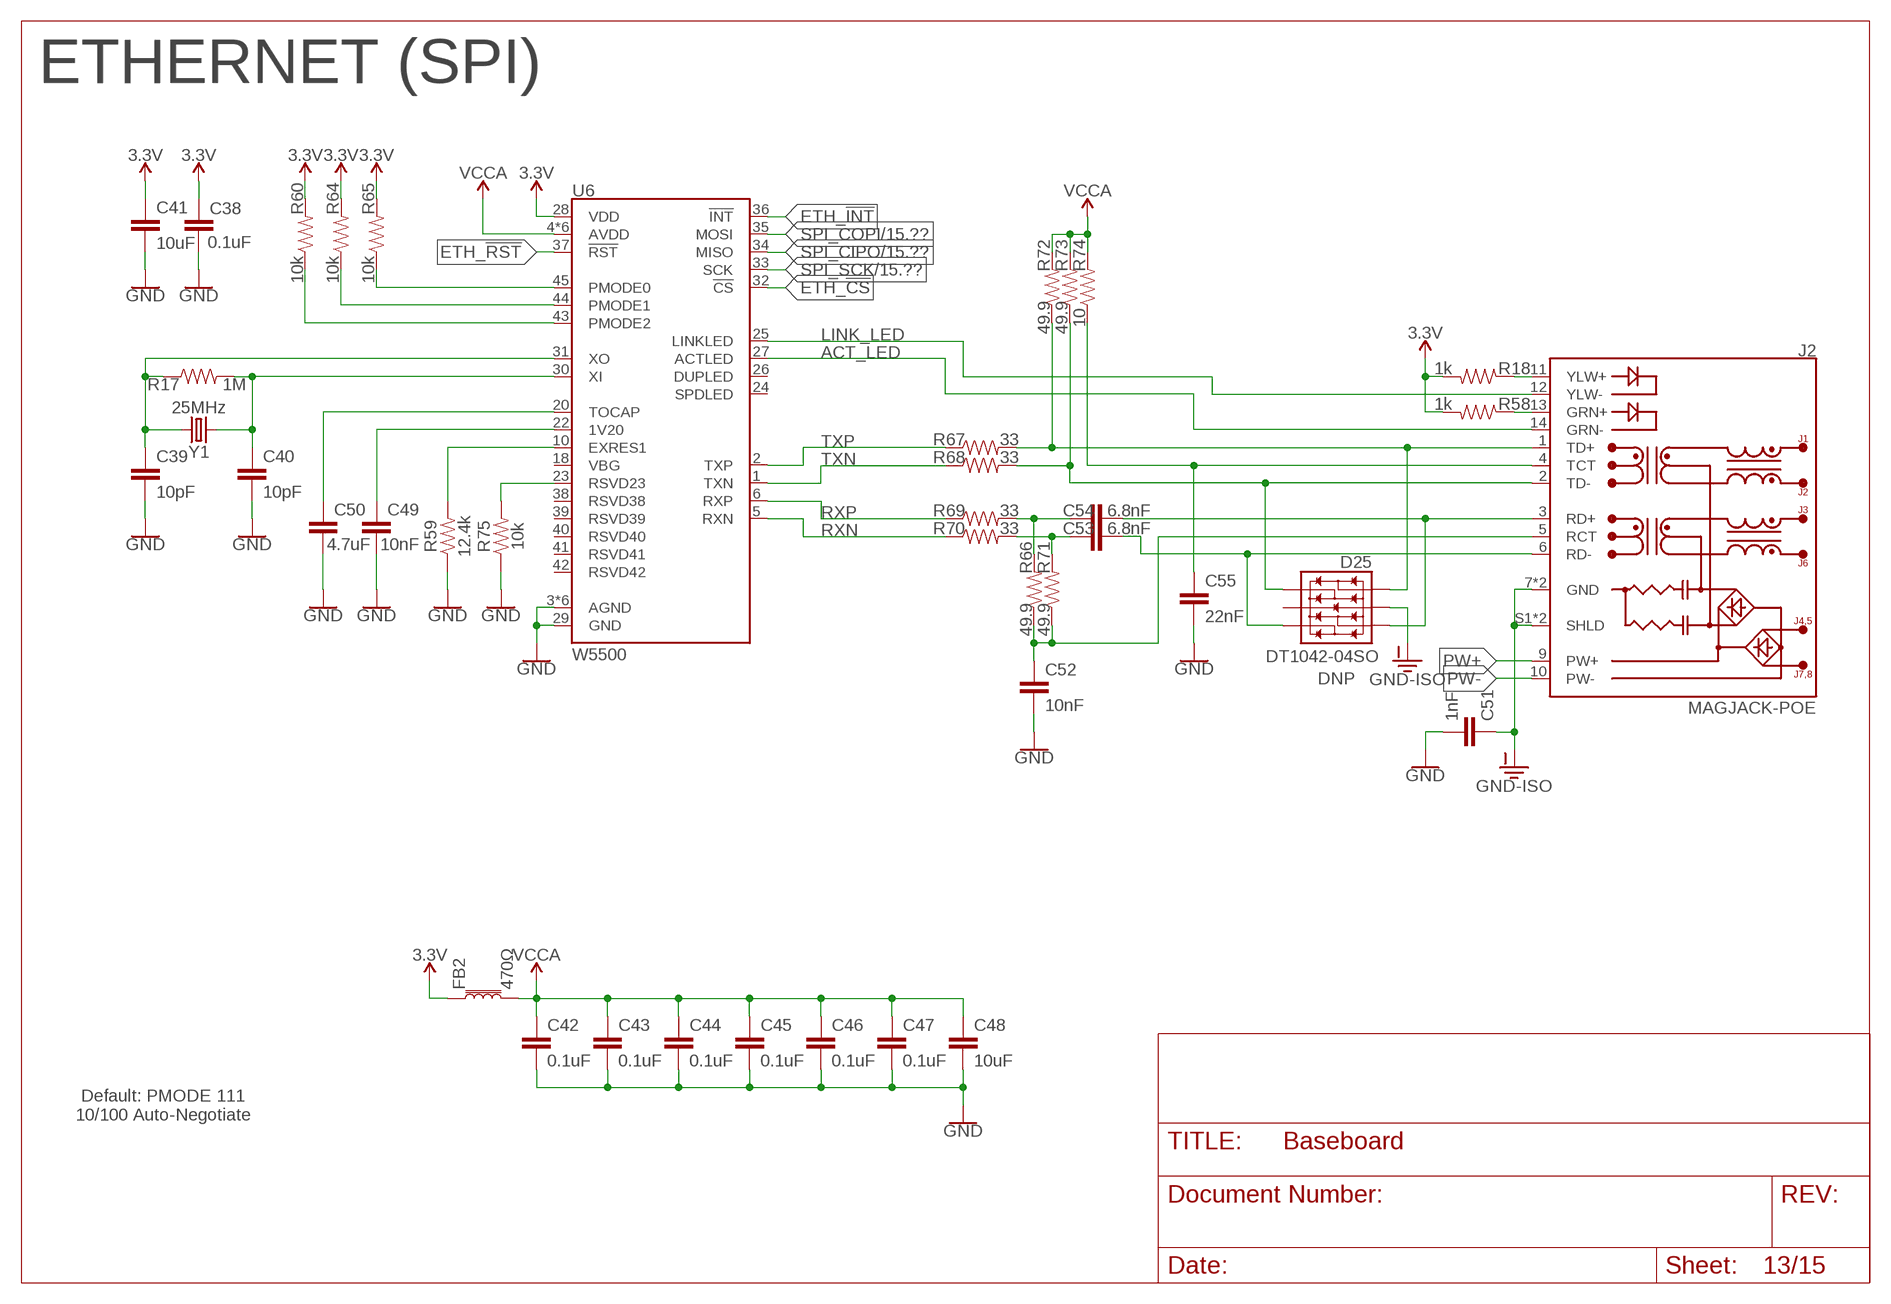
[diagram p12: schematic, sheet 13]

### Parts
C38  0.1uF  0.1UF-0603-25V-(+80/-20%)  [0603]
C39  10pF  10PF-0603-50V-5%  [0603]
C40  10pF  10PF-0603-50V-5%  [0603]
C41  10uF  10UF-0603-6.3V-20%  [0603]
C42  0.1uF  0.1UF-0603-25V-5%  [0603]
C43  0.1uF  0.1UF-0603-25V-5%  [0603]
C44  0.1uF  0.1UF-0603-25V-5%  [0603]
C45  0.1uF  0.1UF-0603-25V-5%  [0603]
C46  0.1uF  0.1UF-0603-25V-5%  [0603]
C47  0.1uF  0.1UF-0603-25V-5%  [0603]
C48  10uF  10UF-0603-6.3V-20%  [0603]
C49  10nF  10NF-0603-50V-10%  [0603]
C50  4.7uF  4.7UF-0603-6.3V-(10%)  [0603]
C51  1nF  1.0NF/1000PF-1206-2KV-10%  [1206]
C52  10nF  10NF-0603-50V-10%  [0603]
C53  6.8nF  6.8NF/6800PF-0603-50V-5%  [0603]
C54  6.8nF  6.8NF/6800PF-0603-50V-5%  [0603]
C55  22nF  22NF/22,000PF-0603-50V-10%  [0603]
D25  DT1042-04SO  TVS_DIODE_ARRAYSMD  [SOT-23-6]
FB2  470Ω  FERRITE_BEAD-0603-470Ω-100MHZ-1A-200MILIΩ  [0603]
J2  MAGJACK-POE  [MAGJACK-SYM_LED]
R17  1M  1MOHM-0603-1/4W-5%  [0603]
R18  1k  1KOHM-0603-1/10W-1%  [0603]
R58  1k  1KOHM-0603-1/10W-1%  [0603]
R59  12.4k  12.4KOHM-0603-1/10W-1%  [0603]
R60  10k  10KOHM-0603-1/10W-1%  [0603]
R64  10k  10KOHM-0603-1/10W-1%  [0603]
R65  10k  10KOHM-0603-1/10W-1%  [0603]
R66  49.9  49.9OHM-0603-1/10W-1%  [0603]
R67  33  33OHM-0603-1/10W-1%  [0603]
R68  33  33OHM-0603-1/10W-1%  [0603]
R69  33  33OHM-0603-1/10W-1%  [0603]
R70  33  33OHM-0603-1/10W-1%  [0603]
R71  49.9  49.9OHM-0603-1/10W-1%  [0603]
R72  49.9  49.9OHM-0603-1/10W-1%  [0603]
R73  49.9  49.9OHM-0603-1/10W-1%  [0603]
R74  10  10OHM-0603-1/10W-1%  [0603]
R75  10k  10KOHM-0603-1/10W-1%  [0603]
U6  W5500  [LQFP-48]
Y1  25MHz  CRYSTAL-25MHZ-SMD-2.0X1.6MM  [CRYSTAL-SMD-2.0X1.6MM]

### Nets
3.3V: C38.1 C41.1 FB2.1 R18.2 R58.2 R60.2 R64.2 R65.2 U6.28(VDD) ; also sheet 14
ACT_LED: J2.14(GRN-) U6.27(ACTLED)
ETH_!CS!: U6.32(!CS!)
ETH_!INT!: U6.36(!INT!)
ETH_!RST!: U6.37(!RST!)
GND: C38.2 C39.2 C40.2 C41.2 C42.2 C43.2 C44.2 C45.2 C46.2 C47.2 C48.2 C49.2 C50.2 C51.2 C52.2 C55.2 R59.1 R75.1 U6.3(AGND) U6.9(AGND) U6.14(AGND) U6.16(AGND) U6.19(AGND) U6.29(GND) U6.48(AGND) ; also sheet 1,2,3,4,5,6,7,8,9,10,11,12,14,15
GND-ISO: C51.1 D25.2(VSS) J2.7(GND) J2.8(GND) J2.S1(SHLD) J2.S2(SHLD)
LINK_LED: J2.12(YLW-) U6.25(LINKLED)
N$39: C39.1 R17.1 U6.31(XO) Y1.1
N$40: C40.1 R17.2 U6.30(XI) Y1.3
N$54: J2.13(GRN+) R58.1
N$55: J2.11(YLW+) R18.1
N$56: R59.2 U6.10(EXRES1)
N$57: C49.1 U6.22(1V20)
N$58: C50.1 U6.20(TOCAP)
N$61: R75.2 U6.23(RSVD23)
PMODE0: R65.1 U6.45(PMODE0)
PMODE1: R64.1 U6.44(PMODE1)
PMODE2: R60.1 U6.43(PMODE2)
PW+: J2.9(PW+)
PW-: J2.10(PW-)
RCT: C52.1 J2.5(RCT) R66.1 R71.1
RD+: C54.2 D25.3(IO2) J2.3(RD+)
RD-: C53.2 D25.4(IO3) J2.6(RD-)
RXN: R70.1 U6.5(RXN)
RXN1: C53.1 R70.2 R71.2
RXP: R69.1 U6.6(RXP)
RXP1: C54.1 R66.2 R69.2
SPI_CIPO: U6.34(MISO) ; also sheet 15
SPI_COPI: U6.35(MOSI) ; also sheet 15
SPI_SCK: U6.33(SCK) ; also sheet 15
TCT: C55.1 J2.4(TCT) R74.1
TD+: D25.1(IO1) J2.1(TD+) R67.2 R72.1
TD-: D25.6(IO4) J2.2(TD-) R68.2 R73.1
TXN: R68.1 U6.1(TXN)
TXP: R67.1 U6.2(TXP)
VCCA: C42.1 C43.1 C44.1 C45.1 C46.1 C47.1 C48.1 FB2.2 R72.2 R73.2 R74.2 U6.4(AVDD) U6.8(AVDD) U6.11(AVDD) U6.15(AVDD) U6.17(AVDD) U6.21(AVDD)
Unconnected: D25.5(VCC) U6.18(VBG) U6.24(SPDLED) U6.26(DUPLED) U6.38(RSVD38) U6.39(RSVD39) U6.40(RSVD40) U6.41(RSVD41) U6.42(RSVD42)

### Notes on the sheet
- ETHERNET (SPI)
- DNP
- Default: PMODE 111
  10/100 Auto-Negotiate

## Sheet 14 of 15
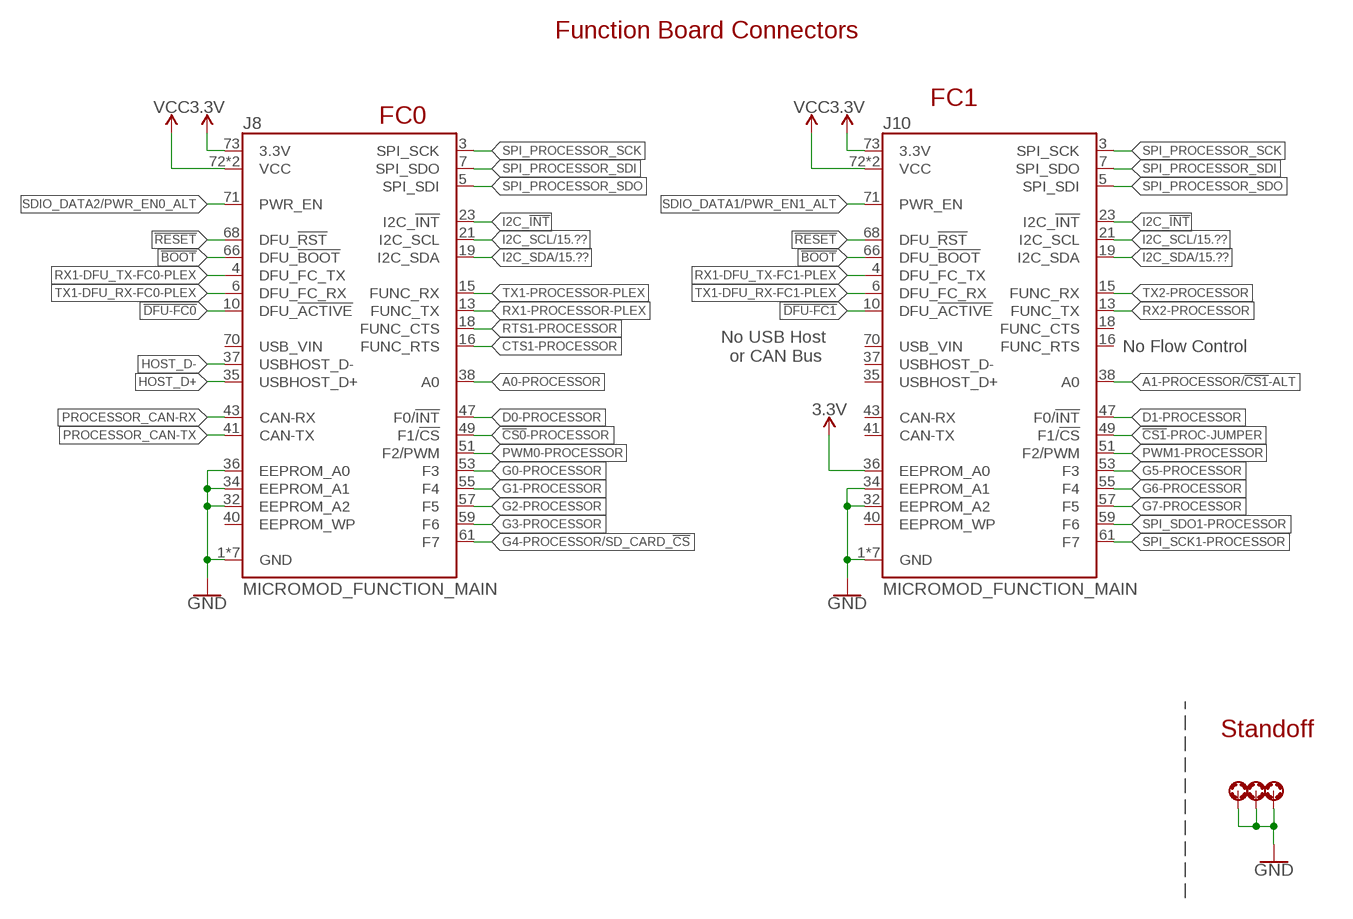
[diagram p13: schematic, sheet 14]

### Parts
H2  STAND-OFF-REFLOW-M2.5_2.5MM_TALL  [STAND-OFF-REFLOW-M2.5]
H3  STAND-OFF-REFLOW-M2.5_2.5MM_TALL  [STAND-OFF-REFLOW-M2.5]
H4  STAND-OFF-REFLOW-M2.5_2.5MM_TALL  [STAND-OFF-REFLOW-M2.5]
J8  MICROMOD_FUNCTION_MAIN  [M.2-CONNECTOR-E-FUNCTION-STANDARD]
J10  MICROMOD_FUNCTION_MAIN  [M.2-CONNECTOR-E-FUNCTION-STANDARD]

### Nets
3.3V: J8.73(3.3V) J10.36(EEPROM_A0) J10.73(3.3V) ; also sheet 13
!BOOT!: J8.66(DFU_!BOOT!) J10.66(DFU_!BOOT!)
!CS0!-PROCESSOR: J8.49(F1/!CS!)
!CS1!-PROC-JUMPER: J10.49(F1/!CS!)
!DFU-FC0!: J8.10(DFU_!ACTIVE!)
!DFU-FC1!: J10.10(DFU_!ACTIVE!)
!RESET!: J8.68(DFU_!RST!) J10.68(DFU_!RST!)
A0-PROCESSOR: J8.38(A0)
A1-PROCESSOR/!CS1!-ALT: J10.38(A0)
CTS1-PROCESSOR: J8.16(FUNC_RTS)
D0-PROCESSOR: J8.47(F0/!INT!)
D1-PROCESSOR: J10.47(F0/!INT!)
G0-PROCESSOR: J8.53(F3)
G1-PROCESSOR: J8.55(F4)
G2-PROCESSOR: J8.57(F5)
G3-PROCESSOR: J8.59(F6)
G4-PROCESSOR/SD_CARD_!CS!: J8.61(F7)
G5-PROCESSOR: J10.53(F3)
G6-PROCESSOR: J10.55(F4)
G7-PROCESSOR: J10.57(F5)
GND: H2.1 H3.1 H4.1 J8.1(GND) J8.2(GND) J8.8(GND) J8.32(EEPROM_A2) J8.33(GND) J8.34(EEPROM_A1) J8.36(EEPROM_A0) J8.39(GND) J8.45(GND) J8.75(GND) J10.1(GND) J10.2(GND) J10.8(GND) J10.32(EEPROM_A2) J10.33(GND) J10.34(EEPROM_A1) J10.39(GND) J10.45(GND) J10.75(GND) ; also sheet 1,2,3,4,5,6,7,8,9,10,11,12,13,15
HOST_D+ [Diff pairs]: J8.35(USBHOST_D+)
HOST_D- [Diff pairs]: J8.37(USBHOST_D-)
I2C_!INT!: J8.23(I2C_!INT!) J10.23(I2C_!INT!)
I2C_SCL: J8.21(I2C_SCL) J10.21(I2C_SCL) ; also sheet 15
I2C_SDA: J8.19(I2C_SDA) J10.19(I2C_SDA) ; also sheet 15
PROCESSOR_CAN-RX: J8.43(CAN-RX)
PROCESSOR_CAN-TX: J8.41(CAN-TX)
PWM0-PROCESSOR: J8.51(F2/PWM)
PWM1-PROCESSOR: J10.51(F2/PWM)
RTS1-PROCESSOR: J8.18(FUNC_CTS)
RX1-DFU_TX-FC0-PLEX: J8.4(DFU_FC_TX)
RX1-DFU_TX-FC1-PLEX: J10.4(DFU_FC_TX)
RX1-PROCESSOR-PLEX: J8.13(FUNC_TX)
RX2-PROCESSOR: J10.13(FUNC_TX)
SDIO_DATA1/PWR_EN1_ALT: J10.71(PWR_EN)
SDIO_DATA2/PWR_EN0_ALT: J8.71(PWR_EN)
SPI_PROCESSOR_SCK: J8.3(SPI_SCK) J10.3(SPI_SCK)
SPI_PROCESSOR_SDI: J8.7(SPI_SDO) J10.7(SPI_SDO)
SPI_PROCESSOR_SDO: J8.5(SPI_SDI) J10.5(SPI_SDI)
SPI_SCK1-PROCESSOR: J10.61(F7)
SPI_SDO1-PROCESSOR: J10.59(F6)
TX1-DFU_RX-FC0-PLEX: J8.6(DFU_FC_RX)
TX1-DFU_RX-FC1-PLEX: J10.6(DFU_FC_RX)
TX1-PROCESSOR-PLEX: J8.15(FUNC_RX)
TX2-PROCESSOR: J10.15(FUNC_RX)
VCC: J8.72(VCC) J8.74(VCC) J10.72(VCC) J10.74(VCC)
Unconnected: J8.40(EEPROM_WP) J8.70(USB_VIN) J10.16(FUNC_RTS) J10.18(FUNC_CTS) J10.35(USBHOST_D+) J10.37(USBHOST_D-) J10.40(EEPROM_WP) J10.41(CAN-TX) J10.43(CAN-RX) J10.70(USB_VIN)

### Notes on the sheet
- Function Board Connectors
- FC1
- FC0
- No USB Host 
  or CAN Bus
- No Flow Control
- Standoff

## Sheet 15 of 15
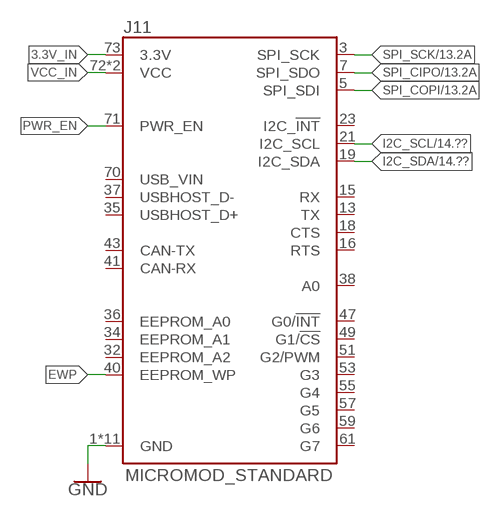
[diagram p14: schematic, sheet 15]

### Parts
J11  MICROMOD_STANDARD  [M.2-CARD-E-22_FUNCTION_STANDARD]

### Nets
3.3V_IN: J11.73(3.3V)
EWP: J11.40(EEPROM_WP)
GND: J11.1(GND) J11.33(GND) J11.39(GND) J11.45(GND) J11.75(GND) J11.GND1(GND) J11.GND2(GND) J11.GND3(GND) J11.GND4(GND) J11.GND5(GND) J11.GND6(GND) ; also sheet 1,2,3,4,5,6,7,8,9,10,11,12,13,14
I2C_SCL: J11.21(I2C_SCL) ; also sheet 14
I2C_SDA: J11.19(I2C_SDA) ; also sheet 14
PWR_EN: J11.71(PWR_EN)
SPI_CIPO: J11.7(SPI_SDO) ; also sheet 13
SPI_COPI: J11.5(SPI_SDI) ; also sheet 13
SPI_SCK: J11.3(SPI_SCK) ; also sheet 13
VCC_IN: J11.72(VCC) J11.74(VCC)
Unconnected: J11.13(TX) J11.15(RX) J11.16(RTS) J11.18(CTS) J11.23(I2C_!INT!) J11.32(EEPROM_A2) J11.34(EEPROM_A1) J11.35(USBHOST_D+) J11.36(EEPROM_A0) J11.37(USBHOST_D-) J11.38(A0) J11.41(CAN-RX) J11.43(CAN-TX) J11.47(G0/!INT!) J11.49(G1/!CS!) J11.51(G2/PWM) J11.53(G3) J11.55(G4) J11.57(G5) J11.59(G6) J11.61(G7) J11.70(USB_VIN)

## Library data of the parts
4-20-1-4-20-4 ADC1-ADC4 INPUT1-INPUT8 MOSFET1-MOSFET8 POWERIN = WJ212R-THR-3.5-3.81:WJ212R-THR-3.5-2
C1 C2 C4 C8 C14 C15 C20 C21 = A9G:DISCRETE_C*: Ceramic Capacitors
C3 C5 C36 C37 = resistor:CPOL-EU: POLARIZED CAPACITOR, European symbol
C6 C9 C10 C12 C24 C27 = microbuilder:CAP_CERAMIC: Ceramic Capacitors For new designs, use the packages preceded by an '_' character since they are more reliable: The following footprints should be used on most boards: _0402 - Standard footprint for regular board layouts _0603 - Standard footprint for regular board layouts _0805 - Standard footprint for regular board layouts _1206 - Standard footprint for regular board layouts For extremely tight-pitch boards where space is at a premium, the following 'micro-pitch' footprints can be used (smaller pads, no silkscreen outline, etc.): _0402MP - Micro-pitch footprint for very dense/compact boards _0603MP - Micro-pitch footprint for very dense/compact boards _0805MP - Micro-pitch footprint for very dense/compact boards _1206MP - Micro-pitch footprint for very dense/compact boards
C7 C11 C13 C16 C19 C22 C23 C25 C26 = discrete:C*: Ceramic Capacitors
C17 = rcl:CPOL-EU: POLARIZED CAPACITOR, European symbol; SPICEPREFIX: C
C18 = SparkFun:CAP: Capacitor Standard 0603 ceramic capacitor, and 0.1" leaded capacitor.
C28-C35 = rcl:C-EU: CAPACITOR, European symbol
C38 = SparkFun-Capacitors:0.1UF: 0.1µF ceramic capacitors A capacitor is a passive two-terminal electrical component used to store electrical energy temporarily in an electric field.; PROD_ID: CAP-00810
C39 C40 = SparkFun-Capacitors:10PF: 10pF ceramic capacitors A capacitor is a passive two-terminal electrical component used to store electrical energy temporarily in an electric field.; PROD_ID: CAP-11812
C41 C48 = SparkFun-Capacitors:10UF: 10.0µF ceramic capacitors A capacitor is a passive two-terminal electrical component used to store electrical energy temporarily in an electric field.; PROD_ID: CAP-11015
C42-C47 = SparkFun-Capacitors:0.1UF: 0.1µF ceramic capacitors A capacitor is a passive two-terminal electrical component used to store electrical energy temporarily in an electric field.; PROD_ID: CAP-08604
C49 C52 = SparkFun-Capacitors:10NF: 0.01uF/10nF/10,000pF ceramic capacitors A capacitor is a passive two-terminal electrical component used to store electrical energy temporarily in an electric field. CAP-09321; PROD_ID: CAP-00867
C50 = SparkFun-Capacitors:4.7UF: 4.7µF ceramic capacitors A capacitor is a passive two-terminal electrical component used to store electrical energy temporarily in an electric field.; PROD_ID: CAP-08280
C51 = SparkFun-Capacitors:1.0NF/1000PF: 1nF/1,000pF ceramic capacitors A capacitor is a passive two-terminal electrical component used to store electrical energy temporarily in an electric field.; PROD_ID: CAP-16238
C53 C54 = SparkFun-Capacitors:6.8NF/6800PF: 5.6nF/5600pF ceramic capacitors A capacitor is a passive two-terminal electrical component used to store electrical energy temporarily in an electric field.; PROD_ID: CAP-16239
C55 = SparkFun-Capacitors:22NF/22,000PF: 0.022uF/22nF/22,000pF ceramic capacitors A capacitor is a passive two-terminal electrical component used to store electrical energy temporarily in an electric field.; PROD_ID: CAP-07885
C107_N0 C107_N1-C107_N7 = rcl:C-EU: CAPACITOR, European symbol; SPICEPREFIX: C
D1 = microbuilder:TVSARRAY_5LANE: Voltage Transient Suppressor Array SOT363 SMF05C - 100W 5V: Digikey - SMF05CT1GOSCT-ND
D2_I1-D2_I8 D2_M1-D2_M8 = led:LED: LED OSRAM: - CHIPLED LG R971, LG N971, LY N971, LG Q971, LY Q971, LO R971, LY R971 LH N974, LH R974 LS Q976, LO Q976, LY Q976 LO Q996 - Hyper CHIPLED LW Q18S LB Q993, LB Q99A, LB R99A - SideLED LS A670, LO A670, LY A670, LG A670, LP A670 LB A673, LV A673, LT A673, LW A673 LH A674 LY A675 LS A676, LA A676, LO A676, LY A676, LW A676 LS A679, LY A679, LG A679 - Hyper Micro SIDELED® LS Y876, LA Y876, LO Y876, LY Y876 LT Y87S - SmartLED LW L88C, LW L88S LB L89C, LB L89S, LG L890 LS L89K, LO L89K, LY L89K LS L896, LA L896, LO L896, LY L896 - TOPLED LS T670, LO T670, LY T670, LG T670, LP T670 LSG T670, LSP T670, LSY T670, LOP T670, LYG T670 LG T671, LOG T671, LSG T671 LB T673, LV T673, LT T673, LW T673 LH T674 LS T676, LA T676, LO T676, LY T676, LB T676, LH T676, LSB T676, LW T676 LB T67C, LV T67C, LT T67C, LS T67K, LO T67K, LY T67K, LW E67C LS E67B, LA E67B, LO E67B, LY E67B, LB E67C, LV E67C, LT E67C LW T67C LS T679, LY T679, LG T679 LS T770, LO T770, LY T770, LG T770, LP T770 LB T773, LV T773, LT T773, LW T773 LH T774 LS E675, LA E675, LY E675, LS T675 LS T776, LA T776, LO T776, LY T776, LB T776 LHGB T686 LT T68C, LB T68C - Hyper Mini TOPLED® LB M676 - Mini TOPLED Santana® LG M470 LS M47K, LO M47K, LY M47K Source: http://www.osram.convergy.de LUXEON: - LUMILED® LXK2-PW12-R00, LXK2-PW12-S00, LXK2-PW14-U00, LXK2-PW14-V00 LXK2-PM12-R00, LXK2-PM12-S00, LXK2-PM14-U00 LXK2-PE12-Q00, LXK2-PE12-R00, LXK2-PE12-S00, LXK2-PE14-T00, LXK2-PE14-U00 LXK2-PB12-K00, LXK2-PB12-L00, LXK2-PB12-M00, LXK2-PB14-N00, LXK2-PB14-P00, LXK2-PB14-Q00 LXK2-PR12-L00, LXK2-PR12-M00, LXK2-PR14-Q00, LXK2-PR14-R00 LXK2-PD12-Q00, LXK2-PD12-R00, LXK2-PD12-S00 LXK2-PH12-R00, LXK2-PH12-S00 LXK2-PL12-P00, LXK2-PL12-Q00, LXK2-PL12-R00 Source: www.luxeon.com KINGBRIGHT: KA-3528ASYC Source: www.kingbright.com
D5 D7 D13 D14 D20 D23 D24 = diode:DIODE-: DIODE
D6 D22 D39 = semicon-smd-ipc:D-: DIODE unfilled
D8-D11 D15 D17-D19 = diode:BAT54S: Schottky Diodes Pin connection corrected 2011-05-04 Source: Fairchild .. BAT54.pdf
D12 D21 = diode:ZENER-DIODE: Z-Diode
D25 = SparkFun-DiscreteSemi:TVS_DIODE_ARRAY; PROD_ID: IC-13538; VALUE: ESD Diode
D30_RL1-D30_RL8 = B5819W:B5819W: Check availability <https://pricing.snapeda.com/parts/B5819W/Microdiode%20Electronics/view-part?ref=eda>; AVAILABILITY: In Stock; CHECK_PRICES: https://www.snapeda.com/parts/B5819W/Applied+Avionics/view-part/?ref=eda; DESCRIPTION: Rectifier Diode Schottky 40V 1A 2-Pin SOD-123; MF: Microdiode Electronics; MP: B5819W; PACKAGE: None; PRICE: None; SNAPEDA_LINK: https://www.snapeda.com/parts/B5819W/Applied+Avionics/view-part/?ref=snap
D51 = SparkFun-DiscreteSemi:DIODE: Diode These are standard reverse protection diodes and small signal diodes. SparkFun Products: SparkFun SparkPunk Sound Kit <https://www.sparkfun.com/products/11177> SparkFun ESP8266 Thing <https://www.sparkfun.com/products/13231>; PROD_ID: DIO-09646; VALUE: 250mA/100V
DS18B20 RELAY = WJ212R-THR-3.5-3.81:WJ212R-THR-3.5-3
F1_RL1-F1_RL8 = polyfuse-smd_10:?: Polyfuse Resettable PTC Source: http://www.littelfuse.com/products/resettable-ptcs.aspx; MF: Littelfuse; MPN: 1206L050; OC_FARNELL: 1596993; OC_NEWARK: 53M6118
FB1 = microbuilder:FERRITE: Ferrite Bead 0603 MMZ1608B121C - 120 Ohm @ 100MHz, 600mA, 0.15 Ohm DC Resistance - Digikey: 445-2164-1-ND BK1608HW121-T - 120 Ohm, 600mA Ferrite Chip - Digikey: 587-1876-2-ND 0805 HZ0805B272R-10 - 2.7K Ohm @ 100MHz, 200mA, 0.8 Ohm DC Resistance - Digikey: 240-2504-1-ND (see also Murata BLM21BD272SN1L) MMZ2012Y152B - 1.5K Ohm @ 100MHz, 500mA, 0.4 Ohm DC Resistance - Digikey: 445-1560-1-ND - Mainly for high frequency (80-400MHz) MMZ2012R102A - 1K Ohm @ 100MHz, 500mA, 0.3 Ohm DC Resistance - Digikey: 445-1555-2-ND - More general purpose (10-200MHz)
FB2 = SparkFun-Coils:FERRITE_BEAD: Ferrite Bead (blocks, cores, rings, chokes, etc.) Inductor with layers of ferrite used to suppress high frequencies. Often used to isolate high frequency noise. SparkFun Products: IOIO-OTG - V2.2 <https://www.sparkfun.com/products/13613> SparkFun SAMD21 Mini Breakout <https://www.sparkfun.com/products/13664> SparkFun 6 Degrees of Freedom Breakout - LSM6DS3 <https://www.sparkfun.com/products/13339> SparkFun SAMD21 Dev Breakout <https://www.sparkfun.com/products/13672>; PROD_ID: NDUC-12579
H2-H4 = SparkFun-Hardware:STAND-OFF-REFLOW: Stand Off Reflow Compatible A metal standoff that can be placed and reflowed onto a PCB. The M2.5 x 2.5mm variant is used on MicroMod. The M2.5 x 1.5mm variant is used to hold mPCIe boards, including the Swarm M138. The M2.0 x 6.0mm variant is used to mount the Iridium 9603N modem.; PROD_ID: HW-14899
IC1 = adafruit:MAX6675
IC2 = CH376S:CH376
IC3 IC4 = linear:LM2596S: STEP-DOWN VOLTAGE REGULATOR
IC5 = v-reg:LD117A?*: Low drop fixed and adjustable positive voltage regulators 1 A Source: http://www.st.com/stonline/products/literature/ds/7194/ld1117axx.pdf
IC6 IC7 = micro-philips:PCF8574: I2C-Bus Remote 8-bit I/O expander http://www.semiconductors.philips.com/acrobat_download/datasheets/PCF8574_4.pdf; MPN: PCF8574T/3,512; OC_FARNELL: 1201255; OC_NEWARK: 70R6870
J1 J3-J6 = SBH11-PBPC-D05-ST-BK:SBH11-PBPC-D05-ST-BK: Check availability <https://pricing.snapeda.com/parts/SBH11-PBPC-D05-ST-BK/Sullins%20Connector/view-part?ref=eda>; AVAILABILITY: In Stock; CHECK_PRICES: https://www.snapeda.com/parts/SBH11-PBPC-D05-ST-BK/Sullins/view-part/?ref=eda; DESCRIPTION: 10 Position Total Dual Row 2.54 mm Pitch Straight Male Shrouded Box Header; MF: Sullins Connector; MP: SBH11-PBPC-D05-ST-BK; PACKAGE: None; PRICE: None; SNAPEDA_LINK: https://www.snapeda.com/parts/SBH11-PBPC-D05-ST-BK/Sullins/view-part/?ref=snap
J2 = SparkFun-Connectors:MAGJACK-POE: MAGJACK: RJ-45 with POE and LEDs This is a single port, RJ45 ethernet jacks with built in transformer (magnetics), PoE rectifier diodes, status LEDs, and shielding.; PROD_ID: CONN-16253
J7 = 110990030 Grove 4 pin:110990030: Check availability <https://pricing.snapeda.com/parts/110990030/Seeed%20Technology/view-part?ref=eda>; AVAILABILITY: In Stock; CHECK_PRICES: https://www.snapeda.com/parts/110990030/Seeed+Studio/view-part/?ref=eda; DESCRIPTION: GROVE 2MM 4PIN VERT CONN 10PCS; MF: Seeed Technology; MP: 110990030; PACKAGE: None; PRICE: None; SNAPEDA_LINK: https://www.snapeda.com/parts/110990030/Seeed+Studio/view-part/?ref=snap
J8 J10 = SparkFun-MicroMod:MICROMOD_FUNCTION: MicroMod Connector Description: A card edge connector and mating PCB connector to allow various MicroMod Processor Boards to be coupled with various carrier boards of different capabilities. Based on the M.2 standard.; PROD_ID: CONN-14877
J9 = adafruit:1X2: 3.5mm Terminal block http://www.ladyada.net/library/pcb/eaglelibrary.html
J11 = SparkFun-MicroMod-Function:MICROMOD: MicroMod Connector Description: A card edge connector and mating PCB connector to allow various MicroMod Processor Boards to be coupled with various carrier boards of different capabilities. Based on the M.2 standard.
L1 L2 = dp_devices.v6:FERRITE: Ferrite bead in various packages
L3 L5 = inductors:DR127: High Power Density, High Efficiency, Shielded Inductors Source: coiltronics_dr_series.pdf; SPICEPREFIX: L
MODE RESET = Right Angle Tactile Switch:RIGHTANGLETACTILE
PT1 PT100 = WJ212R-THR-3.5-3.81:WJ212R-THR-3.5-4
Q2_RL1-Q2_RL8 = mosfet:ST3422A: Nch MOSFET IRLML6344 30V 5A http://akizukidenshi.com/catalog/g/gI-06049/ I-06049
Q34 = transistor-npn:BC849*: NPN Transistor
R1-R4 R6 R8 R21 R23 R47-R50 R55 R56 R62 R63 R78-R81 R84-R111 = resistor:R-EU_: RESISTOR, European symbol
R5 R7 = SparkFun-Resistors:5.1KOHM; PROD_ID: RES-12083
R9 R25 R28 R33 R34 = A9G:DISCRETE_R*
R10-R13 = microbuilder:RESISTOR: Resistors For new designs, use the packages preceded by an '_' character since they are more reliable: The following footprints should be used on most boards: _0402 - Standard footprint for regular board layouts _0603 - Standard footprint for regular board layouts _0805 - Standard footprint for regular board layouts _1206 - Standard footprint for regular board layouts For extremely tight-pitch boards where space is at a premium, the following 'micro-pitch' footprints can be used (smaller pads, no silkscreen outline, etc.): _0402MP - Micro-pitch footprint for very dense/compact boards _0603MP - Micro-pitch footprint for very dense/compact boards _0805MP - Micro-pitch footprint for very dense/compact boards _1206MP - Micro-pitch footprint for very dense/compact boards
R14-R16 R19 R20 R22 R24 R26 R32 R35-R45 R51-R54 = discrete:R*
R17 = SparkFun-Resistors:1MOHM: 1MΩ resistor A resistor is a passive two-terminal electrical component that implements electrical resistance as a circuit element. Resistors act to reduce current flow, and, at the same time, act to lower voltage levels within circuits. - Wikipedia; PROD_ID: RES-07868
R18 R58 = SparkFun-Resistors:1KOHM: 1kΩ resistor A resistor is a passive two-terminal electrical component that implements electrical resistance as a circuit element. Resistors act to reduce current flow, and, at the same time, act to lower voltage levels within circuits. - Wikipedia; PROD_ID: RES-07856
R27 R29-R31 R124_N0 R124_N1-R124_N7 = rcl:R-EU_: RESISTOR, European symbol; SPICEPREFIX: R
R46 R57 R61 R154 R155 = adafruit:R-US_: RESISTOR, American symbol
R59 = SparkFun-Resistors:12.4KOHM: 12.4kΩ resistor A resistor is a passive two-terminal electrical component that implements electrical resistance as a circuit element. Resistors act to reduce current flow, and, at the same time, act to lower voltage levels within circuits. - Wikipedia; PROD_ID: RES-16236
R60 R64 R65 R75 = SparkFun-Resistors:10KOHM: 10kΩ resistor A resistor is a passive two-terminal electrical component that implements electrical resistance as a circuit element. Resistors act to reduce current flow, and, at the same time, act to lower voltage levels within circuits. - Wikipedia; PROD_ID: RES-00824
R66 R71-R73 = SparkFun-Resistors:49.9OHM: 49.9Ω resistor A resistor is a passive two-terminal electrical component that implements electrical resistance as a circuit element. Resistors act to reduce current flow, and, at the same time, act to lower voltage levels within circuits. - Wikipedia; PROD_ID: RES-16237
R67-R70 = SparkFun-Resistors:33OHM: 33Ω resistor A resistor is a passive two-terminal electrical component that implements electrical resistance as a circuit element. Resistors act to reduce current flow, and, at the same time, act to lower voltage levels within circuits. - Wikipedia; PROD_ID: RES-08270
R74 = SparkFun-Resistors:10OHM: 10Ω resistor A resistor is a passive two-terminal electrical component that implements electrical resistance as a circuit element. Resistors act to reduce current flow, and, at the same time, act to lower voltage levels within circuits. - Wikipedia; PROD_ID: RES-12581
R76 R77 R82 R83 = rcl:R-EU_: RESISTOR, European symbol
S1 = switch-dil:219-06*: Surface Mount DIP Switch Series 219 SMT CTS Electronic Components Sourc: www.ctscorp.com; OC_FARNELL: unknown; OC_NEWARK: unknown
SD1 = Connector:HOLDER-MICROSD-9P
SJ1-SJ10 = jumper:SJ: SMD solder JUMPER
U1 = microbuilder:TEMP_MAX31865: MAX31865 - Resistance to Digital Convertor for Platinum Resistance Temperature Detectors (RTDs) Handles 100 ohm - 1K ohm (at 0°C) platinum RTDs. 15-bit ADC resolution (nominally 0.03125°C), 0.5°C accuracy.
U2 = WS2812-2020:WS2812-2020: Check availability <https://pricing.snapeda.com/parts/WS2812-2020/Worldsemi/view-part?ref=eda>; AVAILABILITY: Not in stock; CHECK_PRICES: https://www.snapeda.com/parts/WS2812-2020/Worldsemi/view-part/?ref=eda; DESCRIPTION: Intelligent control LED light source, SMD-4; MF: Worldsemi; MP: WS2812-2020; PACKAGE: Package; PRICE: None; SNAPEDA_LINK: https://www.snapeda.com/parts/WS2812-2020/Worldsemi/view-part/?ref=snap
U3 = ESP32S3WROOM1N8R8:ESP32S3WROOM1N8R8: Check availability <https://pricing.snapeda.com/parts/ESP32S3WROOM1N8R8/Espressif%20Systems/view-part?ref=eda>; AVAILABILITY: In Stock; DESCRIPTION: Bluetooth, WiFi 802.11b/g/n, Bluetooth v5.0 Transceiver Module 2.4GHz PCB Trace Surface Mount; MF: Espressif Systems; MP: ESP32S3WROOM1N8R8; PACKAGE: None; PRICE: None; PURCHASE-URL: https://pricing.snapeda.com/search/part/ESP32S3WROOM1N8R8/?ref=eda
U4 U5 = microbuilder:ADC_ADS1015: ADS1015 - 12-bit 4-Channel I2C ADC with Internal PGA VDD: 2.0-5.5V Sampling Rate: 3.3ksps Gain Settings: 2/3, 1, 2, 4, 8, 16 I2C Address: ADDR low = 1001000x, ADDR high = 1001001x Internal Comparator The ADS1015 includes an internal comparator that can be set to output a high-level on ALERT when the conversion results exceeeds a pre-defined upper level, and will deassert itself when the level falls below a pre-defined lower threshold level. It can also be set to windowed mode where the ALERT pin will be asserted if the data exceeds the upper threshold or falls below the lower threshold.
U6 = SparkFun-IC-Comms:W5500; PROD_ID: IC-16240
U34_N0 U34_N1-U34_N7 = EL357N-G:EL357N-G: Check availability <https://pricing.snapeda.com/parts/EL357N-G/Everlight%20Electronics/view-part?ref=eda>; AVAILABILITY: In Stock; CHECK_PRICES: https://www.snapeda.com/parts/EL357N-G/Everlight/view-part/?ref=eda; DESCRIPTION: Optoisolator Transistor Output 3750Vrms 1 Channel 4-SOP (2.54mm); MF: Everlight Electronics; MP: EL357N-G; PACKAGE: SOP-4 Everlight; PRICE: None; SNAPEDA_LINK: https://www.snapeda.com/parts/EL357N-G/Everlight/view-part/?ref=snap
U$12 = JRC-21F:JRC-21F-4100
USB = SparkFun-Connectors:USB_C: USB Type C 16Pin Connector Super Speed pins not available on the 16-pin purely SMD connector so this part is best for USB 2.0 implementations. D1 and D2 are tied together enabling D+/- no matter which way the cable is plugged into the connector. The two channel configuration pins (CC1/2) are exposed. These are normally connected to ground via 5.1k resistors but can be reconfigured for high current/high power applications.; PROD_ID: CONN-14122
USB1 = con-usb-2:USB: USB Connectors
X1 = bt_con-jst-xh:04-JST: JST CONNECTOR
XTAL2 = microbuilder:CRYSTAL: Crystals HC49UP - Surface Mount Crystal 4.0MHz 18pF +/-30ppm Surface Mount Crystal [Digikey: 535-9857-1-ND] 12.0 MHz Surface Mount Crystal [Digikey: 535-9869-6-ND] 25.0 MHz Surface Mount Crystal [Digikey: 535-9078-1-ND] 3.2 x 2.5mm - MEMs SMT Crystal 12.0 MHz 8pF 15ppm 3.2 x 2.5mm Crystal [Digikey: -10-70°C: 644-1047-1-ND -40-125°C: 644-1128-1-ND] 16.0 MHz 8pF 15ppm 3.2 x 2.5mm Crystal [Digikey: -10-70°C: 644-1049-1-ND -40-125°C: 644-1129-2-ND] 16.0 MHz 10pF 10ppm 3.2 x 2.5mm Crystal [Digikey: 644-1100-1-ND] 27.12 MHz 18pF 30ppm 3.2 x 2.5mm Crystal [Digikey: 887-1424-1-ND] 27.12MHz 10pF 10ppm 3.2 x 2.5mm Crystal [Digikey: 887-1329-1-ND] 4.9 x 1.8mm - MEMs SMT Crystal 32.768 KHz 12.5pF 20ppm 4.9 x 1.8mm Crystal [Digikey: SE2415CT-ND] Cylinder 32.768KHz Cylinder Crystal
Y1 = SparkFun-Clocks:CRYSTAL-25MHZ: 25MHz Crystal; PROD_ID: XTAL-16235

## Net classes
0 default: width 0 mm, drill 0 mm
1 POWER: width 0.559 mm, drill 0.305 mm
2 Diff pairs: width 0.203 mm, drill 0.305 mm